# Altium project RK3568-SOM.PrjPcb (part 3 of 3)

## Sheet RK3568-SOM-EDGE_CONNECTOR.SchDoc
size A2; Organization: Altium Limited; Address1: L3, 12a Rodborough Rd; Address2: Frenchs Forest; Address3: NSW; Address4: Australia 2086
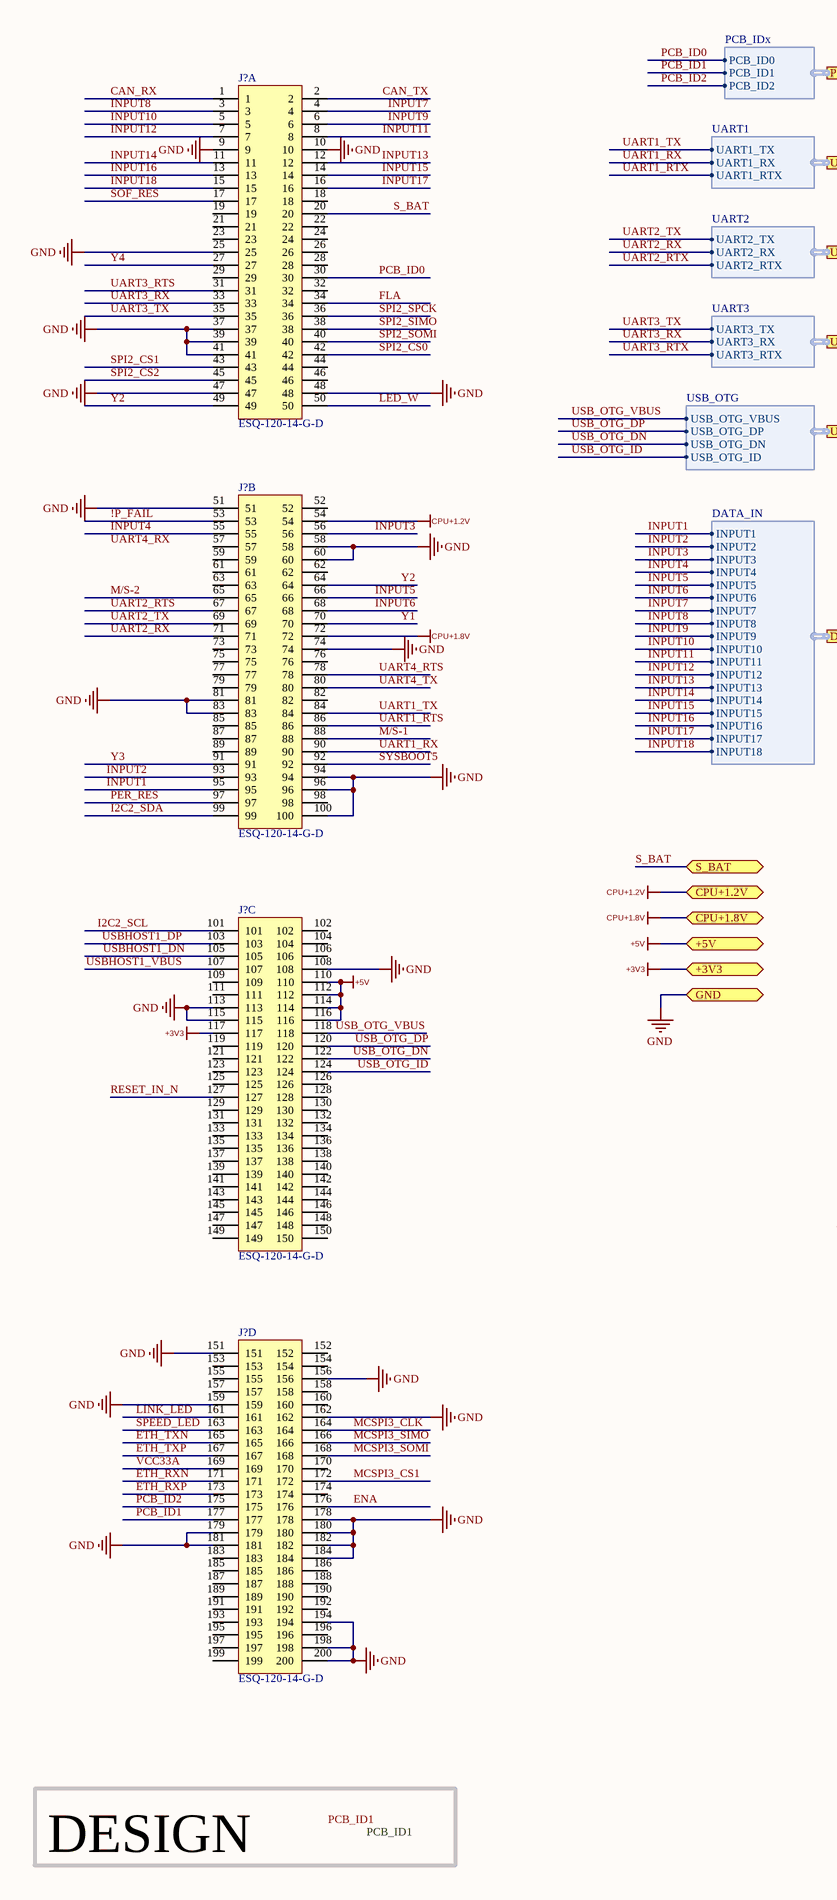
[diagram p8: RK3568-SOM-EDGE_CONNECTOR.SchDoc, left]
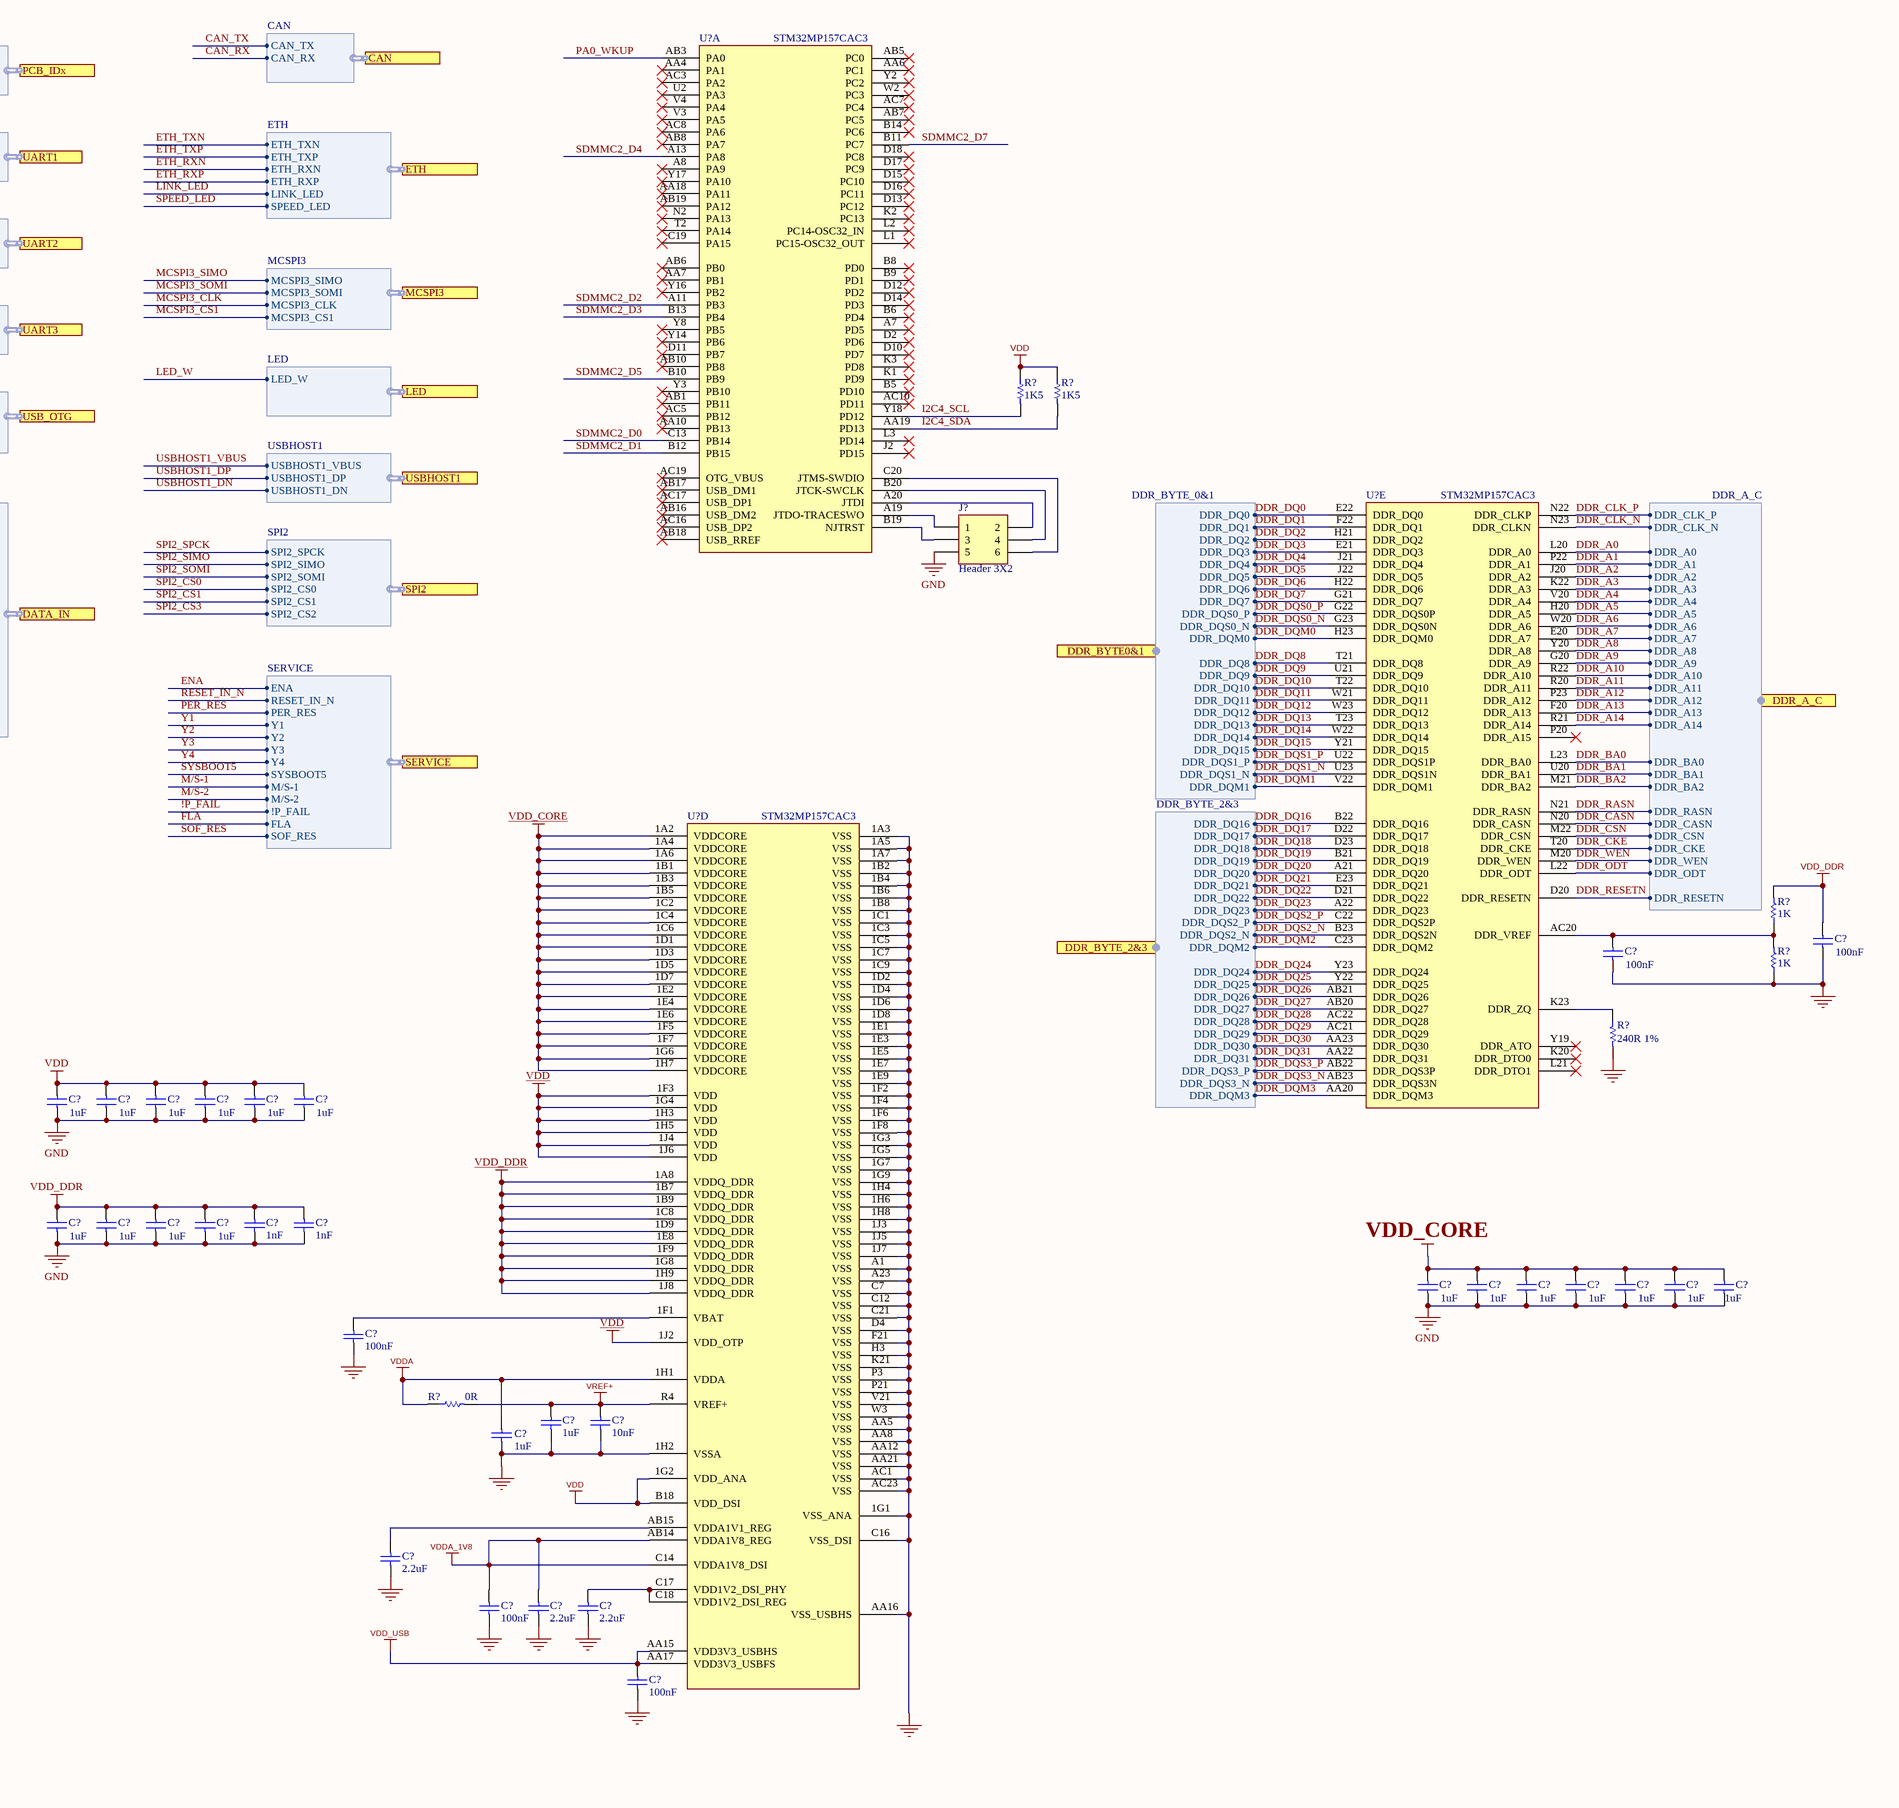
[diagram p9: RK3568-SOM-EDGE_CONNECTOR.SchDoc, right]

### Parts
(Parts that share a designator on the sheet are numbered #1, #2 ... from top to bottom, then left to right.)
C?#19  value 100nF  [C0402]  (hidden comment: Capacitor)
C?#20  value 100nF  [C0402]  (hidden comment: Capacitor)
C?#21  value 1uF  [C0402]  (hidden comment: Capacitor)
C?#22  value 1uF  [C0402]  (hidden comment: Capacitor)
C?#23  value 1uF  [C0402]  (hidden comment: Capacitor)
C?#24  value 1uF  [C0402]  (hidden comment: Capacitor)
C?#25  value 1uF  [C0402]  (hidden comment: Capacitor)
C?#26  value 1uF  [C0402]  (hidden comment: Capacitor)
C?#27  value 1uF  [C0402]  (hidden comment: Capacitor)
C?#28  value 1uF  [C0402]  (hidden comment: Capacitor)
C?#29  value 1uF  [C0402]  (hidden comment: Capacitor)
C?#30  value 1uF  [C0402]  (hidden comment: Capacitor)
C?#31  value 1nF  [C0402]  (hidden comment: Capacitor)
C?#32  value 1nF  [C0402]  (hidden comment: Capacitor)
C?#33  value 1uF  [C0402]  (hidden comment: Capacitor)
C?#34  value 1uF  [C0402]  (hidden comment: Capacitor)
C?#35  value 1uF  [C0402]  (hidden comment: Capacitor)
C?#36  value 1uF  [C0402]  (hidden comment: Capacitor)
C?#37  value 1uF  [C0402]  (hidden comment: Capacitor)
C?#38  value 1uF  [C0402]  (hidden comment: Capacitor)
C?#39  value 1uF  [C0402]  (hidden comment: Capacitor)
C?#40  value 100nF  [C0402]  (hidden comment: Capacitor)
C?#41  value 1uF  [C0402]  (hidden comment: Capacitor)
C?#42  value 10nF  [C0402]  (hidden comment: Capacitor)
C?#43  value 1uF  [C0402]  (hidden comment: Capacitor)
C?#44  value 2.2uF  [C0402]  (hidden comment: Capacitor)
C?#45  value 100nF  [C0402]  (hidden comment: Capacitor)
C?#46  value 2.2uF  [C0402]  (hidden comment: Capacitor)
C?#47  value 2.2uF  [C0402]  (hidden comment: Capacitor)
C?#48  value 100nF  [C0402]  (hidden comment: Capacitor)
J?#1  ESQ-120-14-G-D  [ESQ-120-14-G-D]  (part A of 4)
J?#2  Header 3X2  [Header3x2]
J?#3  ESQ-120-14-G-D  [ESQ-120-14-G-D]  (part B of 4)
J?#4  ESQ-120-14-G-D  [ESQ-120-14-G-D]  (part C of 4)
J?#5  ESQ-120-14-G-D  [ESQ-120-14-G-D]  (part D of 4)
R?#33  value 1K5  [R0402]  (hidden comment: Resistor)
R?#34  value 1K5  [R0402]  (hidden comment: Resistor)
R?#35  value 1K  [R0402]  (hidden comment: Resistor)
R?#36  value 1K  [R0402]  (hidden comment: Resistor)
R?#37  value 240R 1%  [R0402]  (hidden comment: Resistor)
R?#38  value 0R  [R0402]  (hidden comment: Resistor)
U?#5  STM32MP157CAC3  [ICC_TFBGA361_12X12_STM32MP157CAC3_P050-065]  (part A of 5)
U?#6  STM32MP157CAC3  [ICC_TFBGA361_12X12_STM32MP157CAC3_P050-065]  (part E of 5)
U?#7  STM32MP157CAC3  [ICC_TFBGA361_12X12_STM32MP157CAC3_P050-065]  (part D of 5)

### Ports
+3V3 (bidir), +5V (bidir), CAN (harness CAN), CPU+1.2V (bidir), CPU+1.8V (bidir), DATA_IN (harness DATA_IN), DDR_A_C (harness DDR_A_C), DDR_BYTE0&1 (harness DDR_BYTE_0&1), DDR_BYTE_2&3 (harness DDR_BYTE_2&3), ETH (harness ETH), GND (bidir), LED (harness LED), MCSPI3 (harness MCSPI3), PCB_IDx (harness PCB_IDx), S_BAT (bidir), SERVICE (harness SERVICE), SPI2 (harness SPI2), UART1 (harness UART1), UART2 (harness UART2), UART3 (harness UART3), USB_OTG (harness USB_OTG), USBHOST1 (harness USBHOST1)

### Harnesses
DDR_BYTE_0&1: DDR_DQ0, DDR_DQ1, DDR_DQ2, DDR_DQ3, DDR_DQ4, DDR_DQ5, DDR_DQ6, DDR_DQ7, DDR_DQS0_P, DDR_DQS0_N, DDR_DQM0, DDR_DQ8, DDR_DQ9, DDR_DQ10, DDR_DQ11, DDR_DQ12, DDR_DQ13, DDR_DQ14, DDR_DQ15, DDR_DQS1_P, DDR_DQS1_N, DDR_DQM1
DDR_A_C: DDR_CLK_P, DDR_CLK_N, DDR_A0, DDR_A1, DDR_A2, DDR_A3, DDR_A4, DDR_A5, DDR_A6, DDR_A7, DDR_A8, DDR_A9, DDR_A10, DDR_A11, DDR_A12, DDR_A13, DDR_A14, DDR_BA0, DDR_BA1, DDR_BA2, DDR_RASN, DDR_CASN, DDR_CSN, DDR_CKE, DDR_WEN, DDR_ODT, DDR_RESETN
DDR_BYTE_2&3: DDR_DQ16, DDR_DQ17, DDR_DQ18, DDR_DQ19, DDR_DQ20, DDR_DQ21, DDR_DQ22, DDR_DQ23, DDR_DQS2_P, DDR_DQS2_N, DDR_DQM2, DDR_DQ24, DDR_DQ25, DDR_DQ26, DDR_DQ27, DDR_DQ28, DDR_DQ29, DDR_DQ30, DDR_DQ31, DDR_DQS3_P, DDR_DQS3_N, DDR_DQM3
PCB_IDx: PCB_ID0, PCB_ID1, PCB_ID2
UART1: UART1_TX, UART1_RX, UART1_RTX
UART2: UART2_TX, UART2_RX, UART2_RTX
UART3: UART3_TX, UART3_RX, UART3_RTX
USB_OTG: USB_OTG_VBUS, USB_OTG_DP, USB_OTG_DN, USB_OTG_ID
DATA_IN: INPUT1, INPUT2, INPUT3, INPUT4, INPUT5, INPUT6, INPUT7, INPUT8, INPUT9, INPUT10, INPUT11, INPUT12, INPUT13, INPUT14, INPUT15, INPUT16, INPUT17, INPUT18
CAN: CAN_TX, CAN_RX
USBHOST1: USBHOST1_VBUS, USBHOST1_DP, USBHOST1_DN
SPI2: SPI2_SPCK, SPI2_CS0, SPI2_CS1, SPI2_CS2, SPI2_SIMO, SPI2_SOMI
LED: LED_W
SERVICE: ENA, Y4, SYSBOOT5, M/S-1, RESET_IN_N, Y3, PER_RES, Y1, Y2, M/S-2, !P_FAIL, FLA, SOF_RES
MCSPI3: MCSPI3_SIMO, MCSPI3_SOMI, MCSPI3_CLK, MCSPI3_CS1
ETH: ETH_TXN, ETH_TXP, ETH_RXN, ETH_RXP, LINK_LED, SPEED_LED

### Nets
+3V3: J?#4.117 ; port +3V3
+5V: J?#4.110 J?#4.112 J?#4.114 J?#4.116 ; port +5V
CPU+1.2V: J?#3.54 ; port CPU+1.2V
CPU+1.8V: J?#3.72 ; port CPU+1.8V
GND: C?#19.1 C?#20.1 C?#21.1 C?#22.1 C?#23.1 C?#24.1 C?#25.1 C?#26.1 C?#27.1 C?#28.1 C?#29.1 C?#30.1 C?#31.1 C?#32.1 C?#33.1 C?#34.1 C?#35.1 C?#36.1 C?#37.1 C?#38.1 C?#39.1 C?#40.1 C?#41.1 C?#42.1 C?#43.1 C?#44.1 C?#45.1 C?#46.1 C?#47.1 C?#48.1 J?#1.9 J?#1.10 J?#1.25 J?#1.37 J?#1.39 J?#1.41 J?#1.47 J?#1.48 J?#2.5 J?#3.51 J?#3.58 J?#3.60 J?#3.74 J?#3.81 J?#3.83 J?#3.94 J?#3.96 J?#3.100 J?#4.108 J?#4.113 J?#4.115 J?#5.151 J?#5.156 J?#5.159 J?#5.162 J?#5.178 J?#5.179 J?#5.180 J?#5.181 J?#5.182 J?#5.184 J?#5.194 J?#5.198 J?#5.200 R?#36.1 R?#37.2 U?#7.1A3(VSS) U?#7.1A5(VSS) U?#7.1A7(VSS) U?#7.1B2(VSS) U?#7.1B4(VSS) U?#7.1B6(VSS) U?#7.1B8(VSS) U?#7.1C1(VSS) U?#7.1C3(VSS) U?#7.1C5(VSS) U?#7.1C7(VSS) U?#7.1C9(VSS) U?#7.1D2(VSS) U?#7.1D4(VSS) U?#7.1D6(VSS) U?#7.1D8(VSS) U?#7.1E1(VSS) U?#7.1E3(VSS) U?#7.1E5(VSS) U?#7.1E7(VSS) U?#7.1E9(VSS) U?#7.1F2(VSS) U?#7.1F4(VSS) U?#7.1F6(VSS) U?#7.1F8(VSS) U?#7.1G1(VSS_ANA) U?#7.1G3(VSS) U?#7.1G5(VSS) U?#7.1G7(VSS) U?#7.1G9(VSS) U?#7.1H2(VSSA) U?#7.1H4(VSS) U?#7.1H6(VSS) U?#7.1H8(VSS) U?#7.1J3(VSS) U?#7.1J5(VSS) U?#7.1J7(VSS) U?#7.A1(VSS) U?#7.A23(VSS) U?#7.AA5(VSS) U?#7.AA8(VSS) U?#7.AA12(VSS) U?#7.AA16(VSS_USBHS) U?#7.AA21(VSS) U?#7.AC1(VSS) U?#7.AC23(VSS) U?#7.C7(VSS) U?#7.C12(VSS) U?#7.C16(VSS_DSI) U?#7.C21(VSS) U?#7.D4(VSS) U?#7.F21(VSS) U?#7.H3(VSS) U?#7.K21(VSS) U?#7.P3(VSS) U?#7.P21(VSS) U?#7.V21(VSS) U?#7.W3(VSS) ; port GND
VDD: C?#21.2 C?#22.2 C?#23.2 C?#24.2 C?#25.2 C?#26.2 R?#33.1 R?#34.1 U?#7.1F3(VDD) U?#7.1G2(VDD_ANA) U?#7.1G4(VDD) U?#7.1H3(VDD) U?#7.1H5(VDD) U?#7.1J2(VDD_OTP) U?#7.1J4(VDD) U?#7.1J6(VDD) U?#7.B18(VDD_DSI)
VDD_CORE: C?#33.2 C?#34.2 C?#35.2 C?#36.2 C?#37.2 C?#38.2 C?#39.2 U?#7.1A2(VDDCORE) U?#7.1A4(VDDCORE) U?#7.1A6(VDDCORE) U?#7.1B1(VDDCORE) U?#7.1B3(VDDCORE) U?#7.1B5(VDDCORE) U?#7.1C2(VDDCORE) U?#7.1C4(VDDCORE) U?#7.1C6(VDDCORE) U?#7.1D1(VDDCORE) U?#7.1D3(VDDCORE) U?#7.1D5(VDDCORE) U?#7.1D7(VDDCORE) U?#7.1E2(VDDCORE) U?#7.1E4(VDDCORE) U?#7.1E6(VDDCORE) U?#7.1F5(VDDCORE) U?#7.1F7(VDDCORE) U?#7.1G6(VDDCORE) U?#7.1H7(VDDCORE)
VDD_DDR: C?#19.2 C?#27.2 C?#28.2 C?#29.2 C?#30.2 C?#31.2 C?#32.2 R?#35.2 U?#7.1A8(VDDQ_DDR) U?#7.1B7(VDDQ_DDR) U?#7.1B9(VDDQ_DDR) U?#7.1C8(VDDQ_DDR) U?#7.1D9(VDDQ_DDR) U?#7.1E8(VDDQ_DDR) U?#7.1F9(VDDQ_DDR) U?#7.1G8(VDDQ_DDR) U?#7.1H9(VDDQ_DDR) U?#7.1J8(VDDQ_DDR)
VDD_USB: C?#48.2 U?#7.AA15(VDD3V3_USBHS) U?#7.AA17(VDD3V3_USBFS)
VDDA: C?#43.2 R?#38.1 U?#7.1H1(VDDA)
VDDA_1V8: C?#45.2 C?#46.2 U?#7.AB14(VDDA1V8_REG) U?#7.C14(VDDA1V8_DSI)
VREF+: C?#41.2 C?#42.2 R?#38.2 U?#7.R4(VREF+)
!P_FAIL: J?#3.53 ; port SERVICE.!P_FAIL
CAN_RX: J?#1.1 ; port CAN.CAN_RX
CAN_TX: J?#1.2 ; port CAN.CAN_TX
DDR_A0: U?#6.L20(DDR_A0) ; port DDR_A_C.DDR_A0
DDR_A1: U?#6.P22(DDR_A1) ; port DDR_A_C.DDR_A1
DDR_A2: U?#6.J20(DDR_A2) ; port DDR_A_C.DDR_A2
DDR_A3: U?#6.K22(DDR_A3) ; port DDR_A_C.DDR_A3
DDR_A4: U?#6.V20(DDR_A4) ; port DDR_A_C.DDR_A4
DDR_A5: U?#6.H20(DDR_A5) ; port DDR_A_C.DDR_A5
DDR_A6: U?#6.W20(DDR_A6) ; port DDR_A_C.DDR_A6
DDR_A7: U?#6.E20(DDR_A7) ; port DDR_A_C.DDR_A7
DDR_A8: U?#6.Y20(DDR_A8) ; port DDR_A_C.DDR_A8
DDR_A9: U?#6.G20(DDR_A9) ; port DDR_A_C.DDR_A9
DDR_A10: U?#6.R22(DDR_A10) ; port DDR_A_C.DDR_A10
DDR_A11: U?#6.R20(DDR_A11) ; port DDR_A_C.DDR_A11
DDR_A12: U?#6.P23(DDR_A12) ; port DDR_A_C.DDR_A12
DDR_A13: U?#6.F20(DDR_A13) ; port DDR_A_C.DDR_A13
DDR_A14: U?#6.R21(DDR_A14) ; port DDR_A_C.DDR_A14
DDR_BA0: U?#6.L23(DDR_BA0) ; port DDR_A_C.DDR_BA0
DDR_BA1: U?#6.U20(DDR_BA1) ; port DDR_A_C.DDR_BA1
DDR_BA2: U?#6.M21(DDR_BA2) ; port DDR_A_C.DDR_BA2
DDR_CASN: U?#6.N20(DDR_CASN) ; port DDR_A_C.DDR_CASN
DDR_CKE: U?#6.T20(DDR_CKE) ; port DDR_A_C.DDR_CKE
DDR_CLK_N: U?#6.N23(DDR_CLKN) ; port DDR_A_C.DDR_CLK_N
DDR_CLK_P: U?#6.N22(DDR_CLKP) ; port DDR_A_C.DDR_CLK_P
DDR_CSN: U?#6.M22(DDR_CSN) ; port DDR_A_C.DDR_CSN
DDR_DQ0: U?#6.E22(DDR_DQ0) ; port DDR_BYTE0&1.DDR_DQ0
DDR_DQ1: U?#6.F22(DDR_DQ1) ; port DDR_BYTE0&1.DDR_DQ1
DDR_DQ2: U?#6.H21(DDR_DQ2) ; port DDR_BYTE0&1.DDR_DQ2
DDR_DQ3: U?#6.E21(DDR_DQ3) ; port DDR_BYTE0&1.DDR_DQ3
DDR_DQ4: U?#6.J21(DDR_DQ4) ; port DDR_BYTE0&1.DDR_DQ4
DDR_DQ5: U?#6.J22(DDR_DQ5) ; port DDR_BYTE0&1.DDR_DQ5
DDR_DQ6: U?#6.H22(DDR_DQ6) ; port DDR_BYTE0&1.DDR_DQ6
DDR_DQ7: U?#6.G21(DDR_DQ7) ; port DDR_BYTE0&1.DDR_DQ7
DDR_DQ8: U?#6.T21(DDR_DQ8) ; port DDR_BYTE0&1.DDR_DQ8
DDR_DQ9: U?#6.U21(DDR_DQ9) ; port DDR_BYTE0&1.DDR_DQ9
DDR_DQ10: U?#6.T22(DDR_DQ10) ; port DDR_BYTE0&1.DDR_DQ10
DDR_DQ11: U?#6.W21(DDR_DQ11) ; port DDR_BYTE0&1.DDR_DQ11
DDR_DQ12: U?#6.W23(DDR_DQ12) ; port DDR_BYTE0&1.DDR_DQ12
DDR_DQ13: U?#6.T23(DDR_DQ13) ; port DDR_BYTE0&1.DDR_DQ13
DDR_DQ14: U?#6.W22(DDR_DQ14) ; port DDR_BYTE0&1.DDR_DQ14
DDR_DQ15: U?#6.Y21(DDR_DQ15) ; port DDR_BYTE0&1.DDR_DQ15
DDR_DQ16: U?#6.B22(DDR_DQ16) ; port DDR_BYTE_2&3.DDR_DQ16
DDR_DQ17: U?#6.D22(DDR_DQ17) ; port DDR_BYTE_2&3.DDR_DQ17
DDR_DQ18: U?#6.D23(DDR_DQ18) ; port DDR_BYTE_2&3.DDR_DQ18
DDR_DQ19: U?#6.B21(DDR_DQ19) ; port DDR_BYTE_2&3.DDR_DQ19
DDR_DQ20: U?#6.A21(DDR_DQ20) ; port DDR_BYTE_2&3.DDR_DQ20
DDR_DQ21: U?#6.E23(DDR_DQ21) ; port DDR_BYTE_2&3.DDR_DQ21
DDR_DQ22: U?#6.D21(DDR_DQ22) ; port DDR_BYTE_2&3.DDR_DQ22
DDR_DQ23: U?#6.A22(DDR_DQ23) ; port DDR_BYTE_2&3.DDR_DQ23
DDR_DQ24: U?#6.Y23(DDR_DQ24) ; port DDR_BYTE_2&3.DDR_DQ24
DDR_DQ25: U?#6.Y22(DDR_DQ25) ; port DDR_BYTE_2&3.DDR_DQ25
DDR_DQ26: U?#6.AB21(DDR_DQ26) ; port DDR_BYTE_2&3.DDR_DQ26
DDR_DQ27: U?#6.AB20(DDR_DQ27) ; port DDR_BYTE_2&3.DDR_DQ27
DDR_DQ28: U?#6.AC22(DDR_DQ28) ; port DDR_BYTE_2&3.DDR_DQ28
DDR_DQ29: U?#6.AC21(DDR_DQ29) ; port DDR_BYTE_2&3.DDR_DQ29
DDR_DQ30: U?#6.AA23(DDR_DQ30) ; port DDR_BYTE_2&3.DDR_DQ30
DDR_DQ31: U?#6.AA22(DDR_DQ31) ; port DDR_BYTE_2&3.DDR_DQ31
DDR_DQM0: U?#6.H23(DDR_DQM0) ; port DDR_BYTE0&1.DDR_DQM0
DDR_DQM1: U?#6.V22(DDR_DQM1) ; port DDR_BYTE0&1.DDR_DQM1
DDR_DQM2: U?#6.C23(DDR_DQM2) ; port DDR_BYTE_2&3.DDR_DQM2
DDR_DQM3: U?#6.AA20(DDR_DQM3) ; port DDR_BYTE_2&3.DDR_DQM3
DDR_DQS0_N: U?#6.G23(DDR_DQS0N) ; port DDR_BYTE0&1.DDR_DQS0_N
DDR_DQS0_P: U?#6.G22(DDR_DQS0P) ; port DDR_BYTE0&1.DDR_DQS0_P
DDR_DQS1_N: U?#6.U23(DDR_DQS1N) ; port DDR_BYTE0&1.DDR_DQS1_N
DDR_DQS1_P: U?#6.U22(DDR_DQS1P) ; port DDR_BYTE0&1.DDR_DQS1_P
DDR_DQS2_N: U?#6.B23(DDR_DQS2N) ; port DDR_BYTE_2&3.DDR_DQS2_N
DDR_DQS2_P: U?#6.C22(DDR_DQS2P) ; port DDR_BYTE_2&3.DDR_DQS2_P
DDR_DQS3_N: U?#6.AB23(DDR_DQS3N) ; port DDR_BYTE_2&3.DDR_DQS3_N
DDR_DQS3_P: U?#6.AB22(DDR_DQS3P) ; port DDR_BYTE_2&3.DDR_DQS3_P
DDR_ODT: U?#6.L22(DDR_ODT) ; port DDR_A_C.DDR_ODT
DDR_RASN: U?#6.N21(DDR_RASN) ; port DDR_A_C.DDR_RASN
DDR_RESETN: U?#6.D20(DDR_RESETN) ; port DDR_A_C.DDR_RESETN
DDR_WEN: U?#6.M20(DDR_WEN) ; port DDR_A_C.DDR_WEN
ENA: J?#5.176 ; port SERVICE.ENA
ETH_RXN: J?#5.171 ; port ETH.ETH_RXN
ETH_RXP: J?#5.173 ; port ETH.ETH_RXP
ETH_TXN: J?#5.165 ; port ETH.ETH_TXN
ETH_TXP: J?#5.167 ; port ETH.ETH_TXP
FLA: J?#1.34 ; port SERVICE.FLA
I2C2_SCL: J?#4.101
I2C2_SDA: J?#3.99
I2C4_SCL: R?#33.2 U?#5.Y18(PD12)
I2C4_SDA: R?#34.2 U?#5.AA19(PD13)
INPUT1: J?#3.95 ; port DATA_IN.INPUT1
INPUT2: J?#3.93 ; port DATA_IN.INPUT2
INPUT3: J?#3.56 ; port DATA_IN.INPUT3
INPUT4: J?#3.55 ; port DATA_IN.INPUT4
INPUT5: J?#3.66 ; port DATA_IN.INPUT5
INPUT6: J?#3.68 ; port DATA_IN.INPUT6
INPUT7: J?#1.4 ; port DATA_IN.INPUT7
INPUT8: J?#1.3 ; port DATA_IN.INPUT8
INPUT9: J?#1.6 ; port DATA_IN.INPUT9
INPUT10: J?#1.5 ; port DATA_IN.INPUT10
INPUT11: J?#1.8 ; port DATA_IN.INPUT11
INPUT12: J?#1.7 ; port DATA_IN.INPUT12
INPUT13: J?#1.12 ; port DATA_IN.INPUT13
INPUT14: J?#1.11 ; port DATA_IN.INPUT14
INPUT15: J?#1.14 ; port DATA_IN.INPUT15
INPUT16: J?#1.13 ; port DATA_IN.INPUT16
INPUT17: J?#1.16 ; port DATA_IN.INPUT17
INPUT18: J?#1.15 ; port DATA_IN.INPUT18
LED_W: J?#1.50 ; port LED.LED_W
LINK_LED: J?#5.161 ; port ETH.LINK_LED
M/S-1: J?#3.88 ; port SERVICE.M/S-1
M/S-2: J?#3.65 ; port SERVICE.M/S-2
MCSPI3_CLK: J?#5.164 ; port MCSPI3.MCSPI3_CLK
MCSPI3_CS1: J?#5.172 ; port MCSPI3.MCSPI3_CS1
MCSPI3_SIMO: J?#5.166 ; port MCSPI3.MCSPI3_SIMO
MCSPI3_SOMI: J?#5.168 ; port MCSPI3.MCSPI3_SOMI
PA0_WKUP: U?#5.AB3(PA0)
PCB_ID0: J?#1.30 ; port PCB_IDx.PCB_ID0
PCB_ID1: J?#5.177 ; port PCB_IDx.PCB_ID1
PCB_ID2: J?#5.175 ; port PCB_IDx.PCB_ID2
PER_RES: J?#3.97 ; port SERVICE.PER_RES
RESET_IN_N: J?#4.127 ; port SERVICE.RESET_IN_N
S_BAT: J?#1.20 ; port S_BAT
SDMMC2_D0: U?#5.C13(PB14)
SDMMC2_D1: U?#5.B12(PB15)
SDMMC2_D2: U?#5.A11(PB3)
SDMMC2_D3: U?#5.B13(PB4)
SDMMC2_D4: U?#5.A13(PA8)
SDMMC2_D5: U?#5.B10(PB9)
SDMMC2_D7: U?#5.B11(PC7)
SOF_RES: J?#1.17 ; port SERVICE.SOF_RES
SPEED_LED: J?#5.163 ; port ETH.SPEED_LED
SPI2_CS0: J?#1.42 ; port SPI2.SPI2_CS0
SPI2_CS1: J?#1.43 ; port SPI2.SPI2_CS1
SPI2_CS2: J?#1.45
SPI2_CS3: port SPI2.SPI2_CS2
SPI2_SIMO: J?#1.38 ; port SPI2.SPI2_SIMO
SPI2_SOMI: J?#1.40 ; port SPI2.SPI2_SOMI
SPI2_SPCK: J?#1.36 ; port SPI2.SPI2_SPCK
SYSBOOT5: J?#3.92 ; port SERVICE.SYSBOOT5
UART1_RTS: J?#3.86
UART1_RTX: port UART1.UART1_RTX
UART1_RX: J?#3.90 ; port UART1.UART1_RX
UART1_TX: J?#3.84 ; port UART1.UART1_TX
UART2_RTS: J?#3.67
UART2_RTX: port UART2.UART2_RTX
UART2_RX: J?#3.71 ; port UART2.UART2_RX
UART2_TX: J?#3.69 ; port UART2.UART2_TX
UART3_RTS: J?#1.31
UART3_RTX: port UART3.UART3_RTX
UART3_RX: J?#1.33 ; port UART3.UART3_RX
UART3_TX: J?#1.35 ; port UART3.UART3_TX
UART4_RTS: J?#3.78
UART4_TX: J?#3.80
USB_OTG_DN: J?#4.122 ; port USB_OTG.USB_OTG_DN
USB_OTG_DP: J?#4.120 ; port USB_OTG.USB_OTG_DP
USB_OTG_ID: J?#4.124 ; port USB_OTG.USB_OTG_ID
USB_OTG_VBUS: J?#4.118 ; port USB_OTG.USB_OTG_VBUS
USBHOST1_DN: J?#4.105 ; port USBHOST1.USBHOST1_DN
USBHOST1_DP: J?#4.103 ; port USBHOST1.USBHOST1_DP
USBHOST1_VBUS: J?#4.107 ; port USBHOST1.USBHOST1_VBUS
VCC33A: J?#5.169
Y1: J?#3.70 ; port SERVICE.Y1
Y2: J?#1.49 J?#3.64 ; port SERVICE.Y2
Y3: J?#3.91 ; port SERVICE.Y3
Y4: J?#1.27 ; port SERVICE.Y4
NetC?#20_2: C?#20.2 R?#35.1 R?#36.2 U?#6.AC20(DDR_VREF)
NetC?#40_2: C?#40.2 U?#7.1F1(VBAT)
NetC?#44_2: C?#44.2 U?#7.AB15(VDDA1V1_REG)
NetC?#47_2: C?#47.2 U?#7.C17(VDD1V2_DSI_PHY) U?#7.C18(VDD1V2_DSI_REG)
NetJ?#2_1: J?#2.1 U?#5.A19(JTDO-TRACESWO)
NetJ?#2_2: J?#2.2 U?#5.A20(JTDI)
NetJ?#2_3: J?#2.3 U?#5.B19(NJTRST)
NetJ?#2_4: J?#2.4 U?#5.B20(JTCK-SWCLK)
NetJ?#2_6: J?#2.6 U?#5.C20(JTMS-SWDIO)
NetR?#37_1: R?#37.1 U?#6.K23(DDR_ZQ)

Not connected (* = marked no-connect by the designer): J?#1 18 19 21 22 23 24 26 28 29 32 44 46; J?#3 52 57 59 61 62 63 73 75 76 77 79 82 85 87 89 98; J?#4 102 104 106 109 111 119 121 123 125 126 128 129 130 131 132 133 134 135 136 137 138 139 140 141 142 143 144 145 146 147 148 149 150; J?#5 152 153 154 155 157 158 160 170 174 183 185 186 187 188 189 190 191 192 193 195 196 197 199; U?#5 A7(PD5)* A8(PA9)* AA4(PA1)* AA6(PC1)* AA7(PB1)* AA10(PB13)* AA18(PA11)* AB1(PB11)* AB5(PC0)* AB6(PB0)* AB7(PC5)* AB8(PA7)* AB10(PB8)* AB16(USB_DM2)* AB17(USB_DM1)* AB18(USB_RREF)* AB19(PA12)* AC3(PA2)* AC5(PB12)* AC7(PC4)* AC8(PA6)* AC10(PD11)* AC16(USB_DP2)* AC17(USB_DP1)* AC19(OTG_VBUS)* B5(PD10)* B6(PD4)* B8(PD0)* B9(PD1)* B14(PC6)* C19(PA15)* D2(PD6)* D10(PD7)* D11(PB7)* D12(PD2)* D13(PC12)* D14(PD3)* D15(PC10)* D16(PC11)* D17(PC9)* D18(PC8)* J2(PD15)* K1(PD9)* K2(PC13)* K3(PD8)* L1(PC15-OSC32_OUT)* L2(PC14-OSC32_IN)* L3(PD14)* N2(PA13)* T2(PA14)* U2(PA3)* V3(PA5)* V4(PA4)* W2(PC3)* Y2(PC2)* Y3(PB10)* Y8(PB5)* Y14(PB6)* Y16(PB2)* Y17(PA10)*; U?#6 K20(DDR_DTO0)* L21(DDR_DTO1)* P20(DDR_A15)* Y19(DDR_ATO)*

### Notes on the sheet
- DESIGN NOTE:
  Net labels with red color are for compatible with old boards:
  Net labels with green color may located on any edge connector pin:
- PCB_ID1
- Labels drawn without touching a wire or pin: UART4_RX
- Title
- Size:
- Date:
- File:
- A2
- Number:
- Time:
- Revision:
- Sheet
- of

### Library data of the parts
C?#19 C?#20 C?#40 C?#48 = MCD-00006: Capacitor, MLCC, 100nF, 16V, X7R, +/-10%, 0402, T=0.5mm; Manufacturer_Part_Number: CC0402KRX7R7BB104; Manufacturer: YAGEO; Alternate_Manufacturer: MURATA; Alternate_Manufacturer_Part_Number: GCM155R71C104KA55D; ECCN_US: EAR99; ECCN_EU: NEC; Provided_By: SUBCO; Order_Code_RS: 616-9701; Internal_Part_Number: MCD-00006; ComponentLink1Description: Datasheet; Status: Released; Part_Type: Capacitor; Package: C0402; ComponentLink1URL: http://tunmcdsvn.tun.st.com/Component_Datasheet_Library/Trunk/Capacitors/Yageo_Multilayer_Capacitor_X7R_series_100pF_to_22uF; Order_Code_Digikey: 311-1338-1-ND; Order_Code_Farnell: 9402047
C?#21-C?#30 C?#33-C?#39 C?#41 C?#43 = MCD-00095: Capacitor, MLCC, 1uF, 25V, X5R, +/-10%, 0402, T=0,5mm; Manufacturer_Part_Number: GRM155R61E105KA12; Manufacturer: MURATA; Alternate_Manufacturer_Part_Number: GRM155R60J105KE19; ECCN_US: EAR99; ECCN_EU: NEC; Provided_By: SUBCO; Order_Code_RS: 846-7287; Internal_Part_Number: MCD-00095; Status: Released; Package: C0402; ComponentLink1Description: Datasheet; Part_Type: Capacitor; Alternate_Manufacturer: MURATA; ComponentLink1URL: http://tunmcdsvn.tun.st.com/Component_Datasheet_Library/Trunk/Capacitors/Murata_Capacitor_GR_series; Order_Code_Digikey: 490-10017-1-ND; Order_Code_Farnell: 2218855
C?#31 C?#32 = MCD-00198: Capacitor, MLCC, 1nF, 16V, X7R, +/-10%, 0402, T=0.5mm; Manufacturer_Part_Number: CC0402KRX7R7BB102; Manufacturer: YAGEO; Provided_By: SUBCO; ECCN_EU: NEC; ECCN_US: EAR99; Internal_Part_Number: MCD-00198; Status: Released; Part_Type: Capacitor; Package: C0402; ComponentLink1Description: Datasheet; ComponentLink1URL: http://tunmcdsvn.tun.st.com/Component_Datasheet_Library/Trunk/Capacitors/Yageo_Multilayer_Capacitor_X7R_series_100pF_to_22uF; Order_Code_Digikey: 311-1352-1-ND; Order_Code_Farnell: 2370642; Order_Code_RS: N/A
C?#42 = MCD-00011: Capacitor, MLCC, 10nF, 16V, X7R, +/-10%, 0402, T=0.5mm; Manufacturer_Part_Number: CC0402KRX7R7BB103; Manufacturer: YAGEO; ECCN_US: EAR99; ECCN_EU: NEC; Provided_By: SUBCO; Order_Code_RS: 669-8688; Internal_Part_Number: MCD-00011; Status: Released; Part_Type: Capacitor; Package: C0402; ComponentLink1Description: Datasheet; ComponentLink1URL: http://tunmcdsvn.tun.st.com/Component_Datasheet_Library/Trunk/Capacitors/Yageo_Multilayer_Capacitor_X7R_series_100pF_to_22uF; Order_Code_Digikey: 311-1042-1-ND; Order_Code_Farnell: 3019275
C?#44 C?#46 C?#47 = MCD-01823: Capacitor,MLCC, 2.2uF, 6V3, X5R,+/-10%, 0402, T=0.5mm; Manufacturer_Part_Number: GRM155R60J225KE95D; Manufacturer: MURATA; ECCN_US: EAR99; ECCN_EU: NEC; Provided_By: SUBCO; Order_Code_RS: 172-6478; Internal_Part_Number: MCD-01823; Status: Released; Part_Type: Capacitor; Package: C0402; ComponentLink1Description: Datasheet; ComponentLink1URL: http://tunmcdsvn.tun.st.com/Component_Datasheet_Library/Trunk/Capacitors/Murata_Capacitor_GR_series; Order_Code_Digikey: 490-12532-1-ND; Order_Code_Farnell: 2695865
C?#45 = MCD-00006: Capacitor, MLCC, 100nF, 16V, X7R, +/-10%, 0402, T=0.5mm; Manufacturer_Part_Number: CC0402KRX7R7BB104; Manufacturer: YAGEO; Alternate_Manufacturer_Part_Number: GCM155R71C104KA55D; Alternate_Manufacturer: MURATA; ECCN_US: EAR99; ECCN_EU: NEC; Provided_By: SUBCO; Order_Code_RS: 616-9701; Internal_Part_Number: MCD-00006; Status: Released; Part_Type: Capacitor; Package: C0402; ComponentLink1Description: Datasheet; ComponentLink1URL: http://tunmcdsvn.tun.st.com/Component_Datasheet_Library/Trunk/Capacitors/Yageo_Multilayer_Capacitor_X7R_series_100pF_to_22uF; Order_Code_Digikey: 311-1338-1-ND; Order_Code_Farnell: 9402047
J?#1 J?#3-J?#5 = SODIMM-SOCKET: CONN RCPT 40POS .100" DUAL GOLD; Manufacturer: TE Connectivity; Manufacturer Part Number: 1717254-4; Connector Type: Receptacle; Number of Positions: 200; Number of Positions Loaded: All; Pitch: 0.100" (2.54mm); .Creator: MM; Supplier 1: Digi-Key; RoHS: RoHS Compliant; Category: Connectors, Interconnects; Stock 1: 51; Pricing 1: 1=7.42, 10=6.864, 50=6.1586, 100=5.7505, 250=5.00852, 500=4.823, 1000=4.6375, 2500=4.452 (USD); Packaging: Tape & Reel; Contact Type: Female Socket; Number of Rows: 2; Row Spacing: 0.100" (2.54mm); Mounting Type: Through Hole; Termination: Solder; Fastening Type: -; Features: -; Contact Finish: Gold; Contact Finish Thickness: 20µin (0.51µm); Color: Black; ComponentLink1URL: https://www.te.com/usa-en/product-1717254-4.html; ComponentLink1Description: DataSheet; Supplier Part Number 1: SAM8767-ND; .Checked PCB: MM; .Checked SCH: MM
J?#2 = Header 3X2: Header, 2-Pin, Dual row; Manufacturer: Harwin; Manufacturer Part Number 1: M20-9980346; Part Description: Connector Header Through Hole 6 position 0.100" (2.54mm); Contact Resistance: 25mR; Max Current Rating: 3A; Number of Positions: 6; Gender: Male; Connector Type: Male Pin; Insulation Resistance: 10GR; Pitch: 2.54mm; Row Spacing: 0.1inch; Supplier 1: Digi-Key; Supplier Part Number 1: 952-2121-ND; RoHS: Yes; Stock 1: 46604; Pricing 1: 1 = 0,24000, 10 = 0,22900, 100 = 0,15860, 500 = 0,13420, 1000 = 0,10980, 5000 = 0,09760, 10000 = 0,08845 (USD); Mount: Through Hole; Color: Black; Contact Material: Brass,Bronze; Housing Color: Black; Housing Material: Nylon; Contact Plating: Tin; Min Operating Temperature: -40°C; Max Operating Temperature: 105°C; Package Quantity: 1000; Packaging: Bag; Termination: Solder; Number of Rows: 2; Number of Contacts: 6; Orientation: Straight; Current Rating: 3A; Length: 7.62mm; Depth: 5.08mm; Contact Mating Length: 0.24inch; Radiation Hardening: No; REACH SVHC: No SVHC; ComponentLink1URL: http://uk.rs-online.com/webdocs/1406/0900766b81406898.pdf; ComponentLink1Description: http://uk.rs-online.com/webdocs/1406/0900766b81406898.pdf; ComponentLink2URL: https://www.verical.com/server-webapp/html/getDatasheet?partID=483857; ComponentLink2Description: https://www.verical.com/server-webapp/html/getDatasheet?partID=483857; ComponentLink3URL: http://www.farnell.com/cad/112195.pdf; ComponentLink3Description: http://www.farnell.com/cad/112195.pdf
R?#33 R?#34 = MCD-00068: Resistor,1K5,0402,1%,1/16W; Manufacturer_Part_Number: RC0402FR-071K5L; Manufacturer: YAGEO; ECCN_US: EAR99; ECCN_EU: NEC; Provided_By: SUBCO; Internal_Part_Number: MCD-00068; ComponentLink1Description: Datasheet; Status: Released; Part_Type: Resistor; ComponentLink1URL: http://tunmcdsvn.tun.st.com/Component_Datasheet_Library/Trunk/Resistors/Yageo_Resistor_RC0402-series; Package: R0402; Order_Code_Digikey: 311-1.50KLRCT-ND; Order_Code_Farnell: 9239251; Order_Code_RS: N/A
R?#35 R?#36 = MCD-00061: Resistor,1K,0402,1%,1/16W; Manufacturer_Part_Number: RC0402FR-071KL; Manufacturer: YAGEO; Provided_By: SUBCO; ECCN_EU: NEC; ECCN_US: EAR99; Internal_Part_Number: MCD-00061; Status: Released; Part_Type: Resistor; Package: R0402; ComponentLink1Description: Datasheet; ComponentLink1URL: http://tunmcdsvn.tun.st.com/Component_Datasheet_Library/Trunk/Resistors/Yageo_Resistor_RC0402-series; Order_Code_Digikey: 311-1.00KLRCT-ND; Order_Code_Farnell: 9239235; Order_Code_RS: N/A
R?#37 = MCD-00120: Resistor,240R,0402,1%,1/16W; Manufacturer_Part_Number: RC0402FR-07240RL; Manufacturer: YAGEO; ECCN_US: EAR99; ECCN_EU: NEC; Provided_By: SUBCO; Internal_Part_Number: MCD-00120; ComponentLink1Description: Datasheet; Status: Released; Part_Type: Resistor; ComponentLink1URL: http://tunmcdsvn.tun.st.com/Component_Datasheet_Library/Trunk/Resistors/Yageo_Resistor_RC0402-series; Package: R0402; Order_Code_Digikey: 311-240LRCT-ND; Order_Code_Farnell: 1458766; Order_Code_RS: N/A
R?#38 = MCD-00052: Resistor,0R,0402,5%,1/16W; Manufacturer_Part_Number: RC0402JR-070RL; Manufacturer: YAGEO; ECCN_US: EAR99; ECCN_EU: NEC; Provided_By: SUBCO; Order_Code_RS: 618-5804; Internal_Part_Number: MCD-00052; Status: Released; Part_Type: Resistor; ComponentLink1Description: Datasheet; ComponentLink1URL: http://tunmcdsvn.tun.st.com/Component_Datasheet_Library/Trunk/Resistors/Yageo_Resistor_RC0402-series; Package: R0402; Order_Code_Digikey: 311-0.0JRCT-ND; Order_Code_Farnell: 9232516RL
U?#5-U?#7 = MCD-00677: MPU TFBGA12x12 secure boot+crypto; Part_Type: IC; Manufacturer: STMICROELECTRONICS; BMS_Part_Number: 9175503; ECCN_US: 5A002A4; ECCN_EU: NEC; Provided_By: SUBCO with ST control; Company_Nationality: Netherlands; Internal_Part_Number: MCD-00677; Value: STM32MP157CAC3; Status: Footprint available; Manufacturer_Part_Number: STM32MP157CAC3; ComponentLink1Description: Datasheet; ComponentLink1URL: http://tunmcdsvn.tun.st.com/Component_Datasheet_Library/Trunk/IC/STM_MPU_12x12_POA_DM00342580_POA12x12; Export_Juridiction: EU; California_Proposition_65: N/A

## Sheet RK3568-SOM-MCU.SchDoc
size A2; Organization: Altium Limited; Address1: L3, 12a Rodborough Rd; Address2: Frenchs Forest; Address3: NSW; Address4: Australia 2086
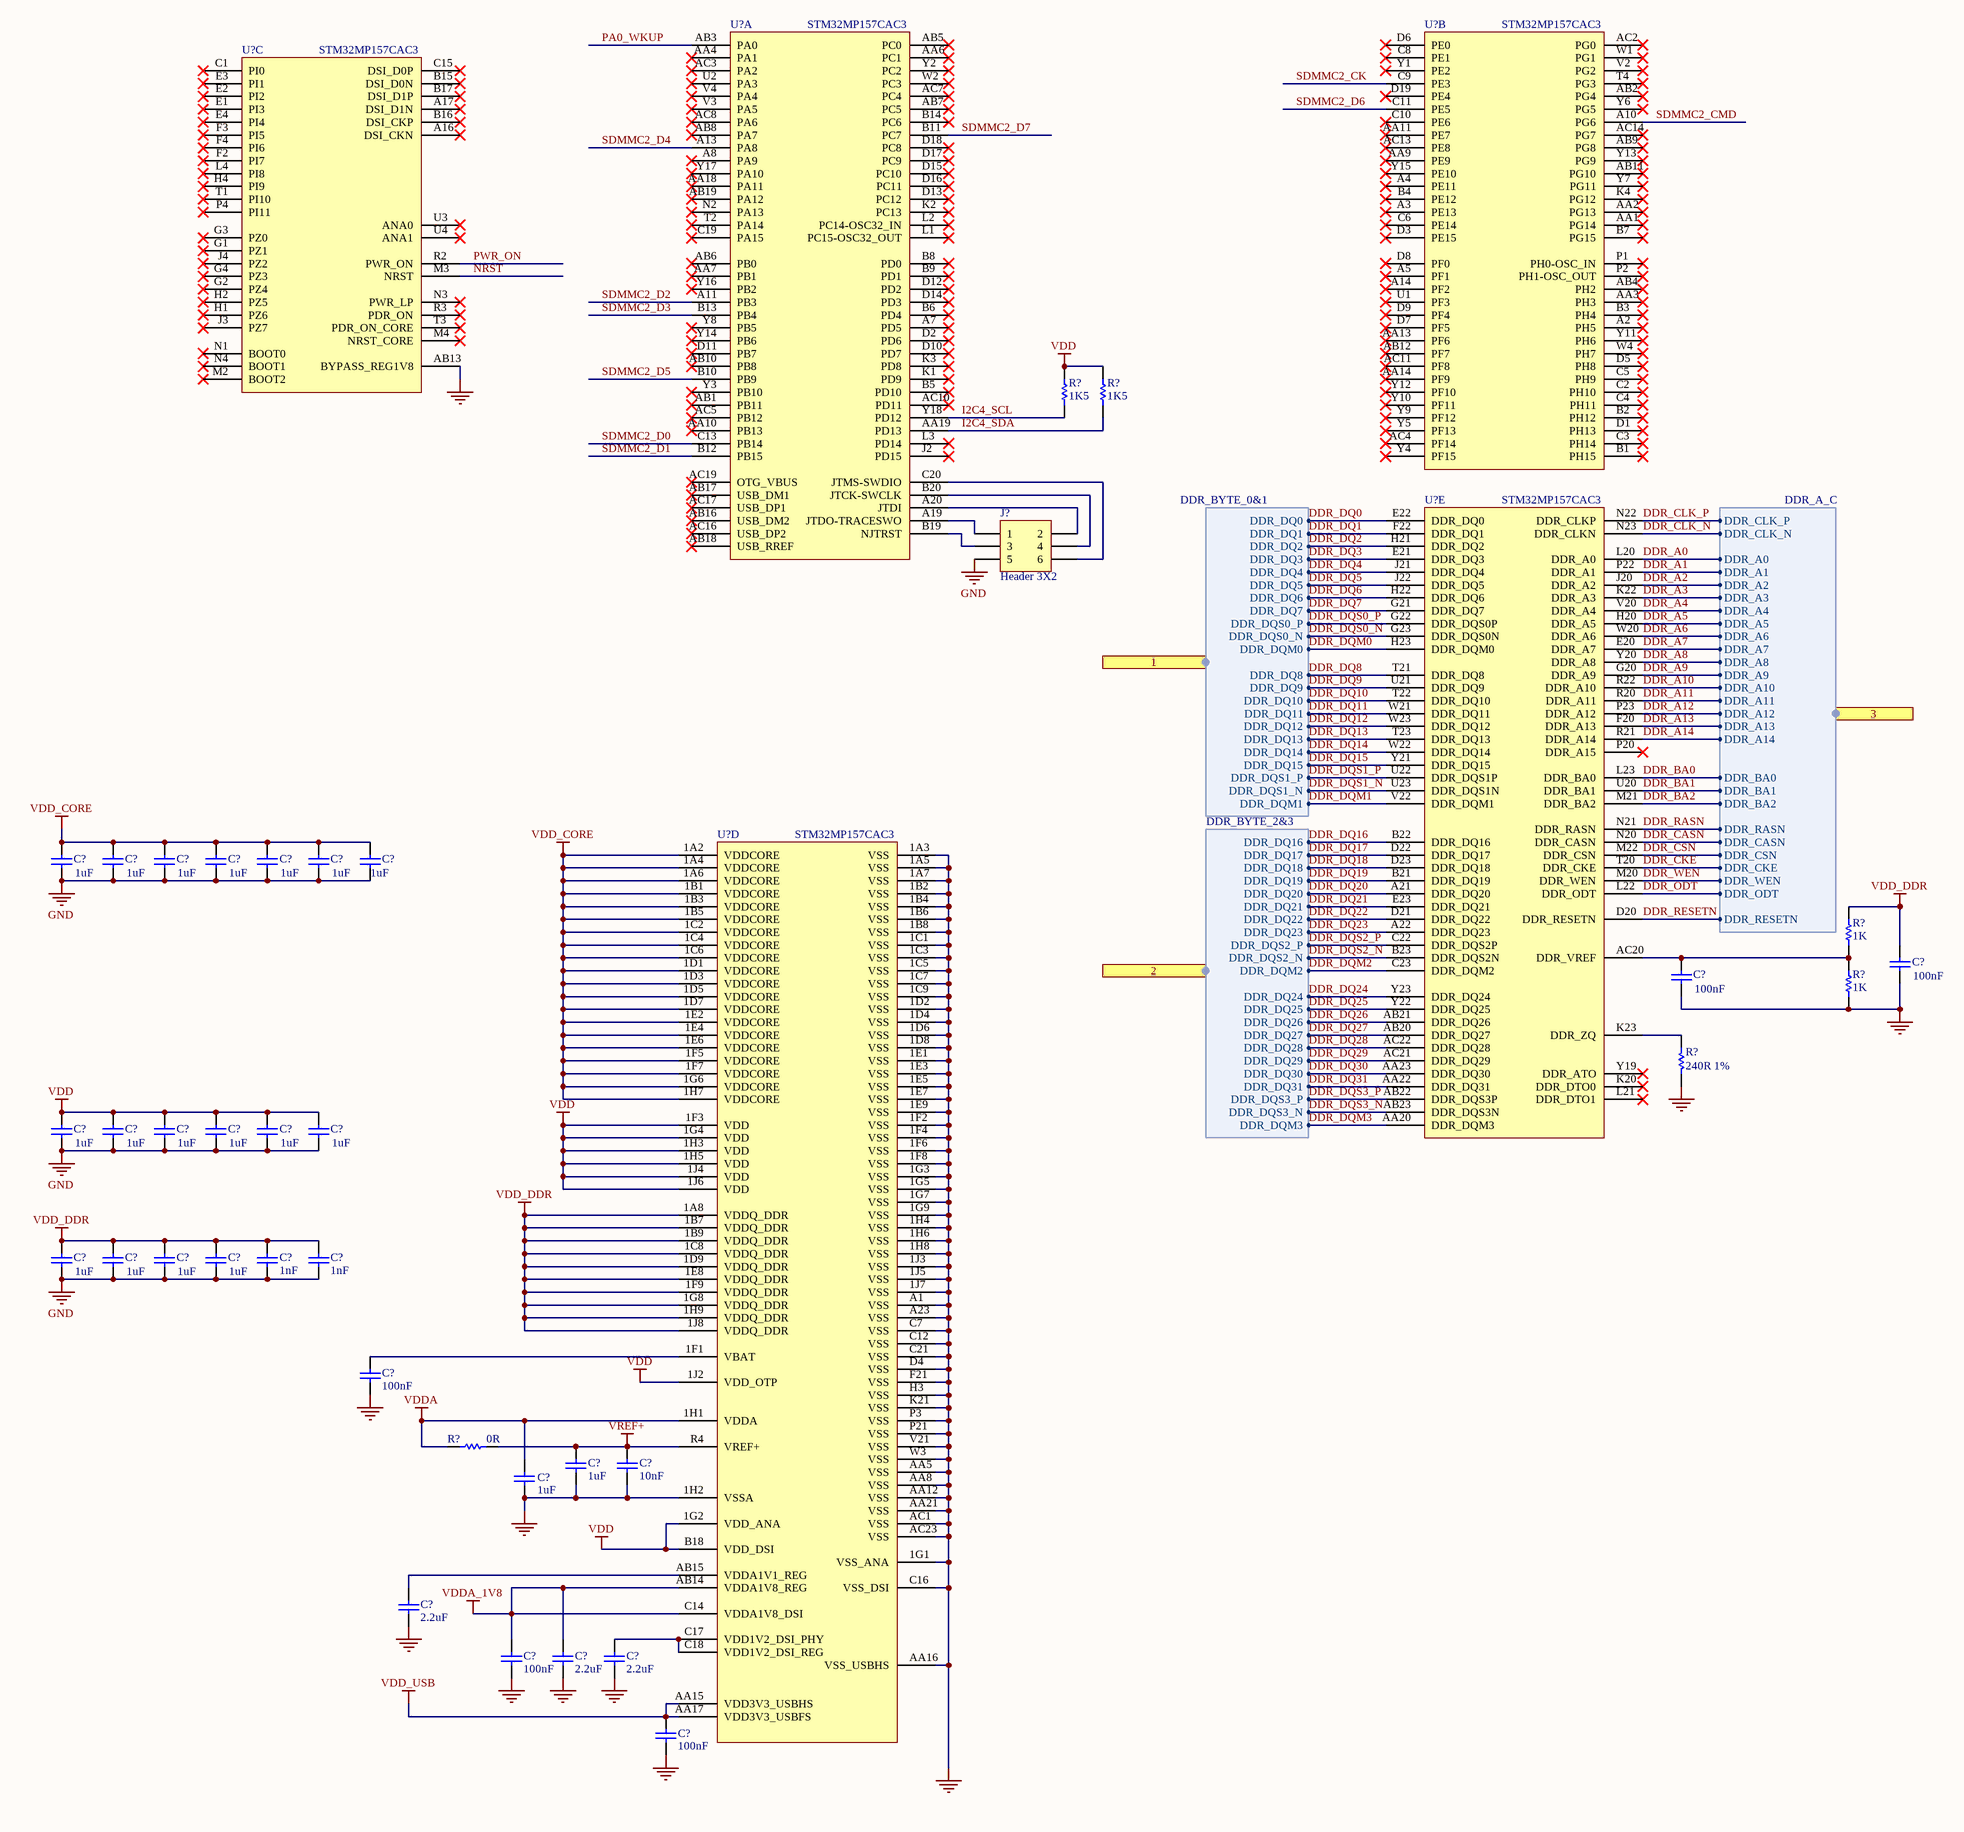
[diagram p10: RK3568-SOM-MCU.SchDoc]

### Parts
(Parts that share a designator on the sheet are numbered #1, #2 ... from top to bottom, then left to right.)
C?#49  value 1uF  [C0402]  (hidden comment: Capacitor)
C?#50  value 1uF  [C0402]  (hidden comment: Capacitor)
C?#51  value 1uF  [C0402]  (hidden comment: Capacitor)
C?#52  value 1uF  [C0402]  (hidden comment: Capacitor)
C?#53  value 1uF  [C0402]  (hidden comment: Capacitor)
C?#54  value 1uF  [C0402]  (hidden comment: Capacitor)
C?#55  value 1uF  [C0402]  (hidden comment: Capacitor)
C?#56  value 100nF  [C0402]  (hidden comment: Capacitor)
C?#57  value 100nF  [C0402]  (hidden comment: Capacitor)
C?#58  value 1uF  [C0402]  (hidden comment: Capacitor)
C?#59  value 1uF  [C0402]  (hidden comment: Capacitor)
C?#60  value 1uF  [C0402]  (hidden comment: Capacitor)
C?#61  value 1uF  [C0402]  (hidden comment: Capacitor)
C?#62  value 1uF  [C0402]  (hidden comment: Capacitor)
C?#63  value 1uF  [C0402]  (hidden comment: Capacitor)
C?#64  value 1uF  [C0402]  (hidden comment: Capacitor)
C?#65  value 1uF  [C0402]  (hidden comment: Capacitor)
C?#66  value 1uF  [C0402]  (hidden comment: Capacitor)
C?#67  value 1uF  [C0402]  (hidden comment: Capacitor)
C?#68  value 1nF  [C0402]  (hidden comment: Capacitor)
C?#69  value 1nF  [C0402]  (hidden comment: Capacitor)
C?#70  value 100nF  [C0402]  (hidden comment: Capacitor)
C?#71  value 1uF  [C0402]  (hidden comment: Capacitor)
C?#72  value 10nF  [C0402]  (hidden comment: Capacitor)
C?#73  value 1uF  [C0402]  (hidden comment: Capacitor)
C?#74  value 2.2uF  [C0402]  (hidden comment: Capacitor)
C?#75  value 100nF  [C0402]  (hidden comment: Capacitor)
C?#76  value 2.2uF  [C0402]  (hidden comment: Capacitor)
C?#77  value 2.2uF  [C0402]  (hidden comment: Capacitor)
C?#78  value 100nF  [C0402]  (hidden comment: Capacitor)
J?#6  Header 3X2  [Header3x2]
R?#39  value 1K5  [R0402]  (hidden comment: Resistor)
R?#40  value 1K5  [R0402]  (hidden comment: Resistor)
R?#41  value 1K  [R0402]  (hidden comment: Resistor)
R?#42  value 1K  [R0402]  (hidden comment: Resistor)
R?#43  value 240R 1%  [R0402]  (hidden comment: Resistor)
R?#44  value 0R  [R0402]  (hidden comment: Resistor)
U?#8  STM32MP157CAC3  [ICC_TFBGA361_12X12_STM32MP157CAC3_P050-065]  (part A of 5)
U?#9  STM32MP157CAC3  [ICC_TFBGA361_12X12_STM32MP157CAC3_P050-065]  (part B of 5)
U?#10  STM32MP157CAC3  [ICC_TFBGA361_12X12_STM32MP157CAC3_P050-065]  (part C of 5)
U?#11  STM32MP157CAC3  [ICC_TFBGA361_12X12_STM32MP157CAC3_P050-065]  (part E of 5)
U?#12  STM32MP157CAC3  [ICC_TFBGA361_12X12_STM32MP157CAC3_P050-065]  (part D of 5)

### Ports
1 (harness DDR_BYTE_0&1), 2 (harness DDR_BYTE_2&3), 3 (harness DDR_A_C)

### Harnesses
DDR_BYTE_0&1: DDR_DQ0, DDR_DQ1, DDR_DQ2, DDR_DQ3, DDR_DQ4, DDR_DQ5, DDR_DQ6, DDR_DQ7, DDR_DQS0_P, DDR_DQS0_N, DDR_DQM0, DDR_DQ8, DDR_DQ9, DDR_DQ10, DDR_DQ11, DDR_DQ12, DDR_DQ13, DDR_DQ14, DDR_DQ15, DDR_DQS1_P, DDR_DQS1_N, DDR_DQM1
DDR_A_C: DDR_CLK_P, DDR_CLK_N, DDR_A0, DDR_A1, DDR_A2, DDR_A3, DDR_A4, DDR_A5, DDR_A6, DDR_A7, DDR_A8, DDR_A9, DDR_A10, DDR_A11, DDR_A12, DDR_A13, DDR_A14, DDR_BA0, DDR_BA1, DDR_BA2, DDR_RASN, DDR_CASN, DDR_CSN, DDR_CKE, DDR_WEN, DDR_ODT, DDR_RESETN
DDR_BYTE_2&3: DDR_DQ16, DDR_DQ17, DDR_DQ18, DDR_DQ19, DDR_DQ20, DDR_DQ21, DDR_DQ22, DDR_DQ23, DDR_DQS2_P, DDR_DQS2_N, DDR_DQM2, DDR_DQ24, DDR_DQ25, DDR_DQ26, DDR_DQ27, DDR_DQ28, DDR_DQ29, DDR_DQ30, DDR_DQ31, DDR_DQS3_P, DDR_DQS3_N, DDR_DQM3

### Nets
GND: C?#49.1 C?#50.1 C?#51.1 C?#52.1 C?#53.1 C?#54.1 C?#55.1 C?#56.1 C?#57.1 C?#58.1 C?#59.1 C?#60.1 C?#61.1 C?#62.1 C?#63.1 C?#64.1 C?#65.1 C?#66.1 C?#67.1 C?#68.1 C?#69.1 C?#70.1 C?#71.1 C?#72.1 C?#73.1 C?#74.1 C?#75.1 C?#76.1 C?#77.1 C?#78.1 J?#6.5 R?#42.1 R?#43.2 U?#10.AB13(BYPASS_REG1V8) U?#12.1A3(VSS) U?#12.1A5(VSS) U?#12.1A7(VSS) U?#12.1B2(VSS) U?#12.1B4(VSS) U?#12.1B6(VSS) U?#12.1B8(VSS) U?#12.1C1(VSS) U?#12.1C3(VSS) U?#12.1C5(VSS) U?#12.1C7(VSS) U?#12.1C9(VSS) U?#12.1D2(VSS) U?#12.1D4(VSS) U?#12.1D6(VSS) U?#12.1D8(VSS) U?#12.1E1(VSS) U?#12.1E3(VSS) U?#12.1E5(VSS) U?#12.1E7(VSS) U?#12.1E9(VSS) U?#12.1F2(VSS) U?#12.1F4(VSS) U?#12.1F6(VSS) U?#12.1F8(VSS) U?#12.1G1(VSS_ANA) U?#12.1G3(VSS) U?#12.1G5(VSS) U?#12.1G7(VSS) U?#12.1G9(VSS) U?#12.1H2(VSSA) U?#12.1H4(VSS) U?#12.1H6(VSS) U?#12.1H8(VSS) U?#12.1J3(VSS) U?#12.1J5(VSS) U?#12.1J7(VSS) U?#12.A1(VSS) U?#12.A23(VSS) U?#12.AA5(VSS) U?#12.AA8(VSS) U?#12.AA12(VSS) U?#12.AA16(VSS_USBHS) U?#12.AA21(VSS) U?#12.AC1(VSS) U?#12.AC23(VSS) U?#12.C7(VSS) U?#12.C12(VSS) U?#12.C16(VSS_DSI) U?#12.C21(VSS) U?#12.D4(VSS) U?#12.F21(VSS) U?#12.H3(VSS) U?#12.K21(VSS) U?#12.P3(VSS) U?#12.P21(VSS) U?#12.V21(VSS) U?#12.W3(VSS)
VDD: C?#58.2 C?#59.2 C?#60.2 C?#61.2 C?#62.2 C?#63.2 R?#39.1 R?#40.1 U?#12.1F3(VDD) U?#12.1G2(VDD_ANA) U?#12.1G4(VDD) U?#12.1H3(VDD) U?#12.1H5(VDD) U?#12.1J2(VDD_OTP) U?#12.1J4(VDD) U?#12.1J6(VDD) U?#12.B18(VDD_DSI)
VDD_CORE: C?#49.2 C?#50.2 C?#51.2 C?#52.2 C?#53.2 C?#54.2 C?#55.2 U?#12.1A2(VDDCORE) U?#12.1A4(VDDCORE) U?#12.1A6(VDDCORE) U?#12.1B1(VDDCORE) U?#12.1B3(VDDCORE) U?#12.1B5(VDDCORE) U?#12.1C2(VDDCORE) U?#12.1C4(VDDCORE) U?#12.1C6(VDDCORE) U?#12.1D1(VDDCORE) U?#12.1D3(VDDCORE) U?#12.1D5(VDDCORE) U?#12.1D7(VDDCORE) U?#12.1E2(VDDCORE) U?#12.1E4(VDDCORE) U?#12.1E6(VDDCORE) U?#12.1F5(VDDCORE) U?#12.1F7(VDDCORE) U?#12.1G6(VDDCORE) U?#12.1H7(VDDCORE)
VDD_DDR: C?#56.2 C?#64.2 C?#65.2 C?#66.2 C?#67.2 C?#68.2 C?#69.2 R?#41.2 U?#12.1A8(VDDQ_DDR) U?#12.1B7(VDDQ_DDR) U?#12.1B9(VDDQ_DDR) U?#12.1C8(VDDQ_DDR) U?#12.1D9(VDDQ_DDR) U?#12.1E8(VDDQ_DDR) U?#12.1F9(VDDQ_DDR) U?#12.1G8(VDDQ_DDR) U?#12.1H9(VDDQ_DDR) U?#12.1J8(VDDQ_DDR)
VDD_USB: C?#78.2 U?#12.AA15(VDD3V3_USBHS) U?#12.AA17(VDD3V3_USBFS)
VDDA: C?#73.2 R?#44.1 U?#12.1H1(VDDA)
VDDA_1V8: C?#75.2 C?#76.2 U?#12.AB14(VDDA1V8_REG) U?#12.C14(VDDA1V8_DSI)
VREF+: C?#71.2 C?#72.2 R?#44.2 U?#12.R4(VREF+)
DDR_A0: U?#11.L20(DDR_A0) ; port 3.DDR_A0
DDR_A1: U?#11.P22(DDR_A1) ; port 3.DDR_A1
DDR_A2: U?#11.J20(DDR_A2) ; port 3.DDR_A2
DDR_A3: U?#11.K22(DDR_A3) ; port 3.DDR_A3
DDR_A4: U?#11.V20(DDR_A4) ; port 3.DDR_A4
DDR_A5: U?#11.H20(DDR_A5) ; port 3.DDR_A5
DDR_A6: U?#11.W20(DDR_A6) ; port 3.DDR_A6
DDR_A7: U?#11.E20(DDR_A7) ; port 3.DDR_A7
DDR_A8: U?#11.Y20(DDR_A8) ; port 3.DDR_A8
DDR_A9: U?#11.G20(DDR_A9) ; port 3.DDR_A9
DDR_A10: U?#11.R22(DDR_A10) ; port 3.DDR_A10
DDR_A11: U?#11.R20(DDR_A11) ; port 3.DDR_A11
DDR_A12: U?#11.P23(DDR_A12) ; port 3.DDR_A12
DDR_A13: U?#11.F20(DDR_A13) ; port 3.DDR_A13
DDR_A14: U?#11.R21(DDR_A14) ; port 3.DDR_A14
DDR_BA0: U?#11.L23(DDR_BA0) ; port 3.DDR_BA0
DDR_BA1: U?#11.U20(DDR_BA1) ; port 3.DDR_BA1
DDR_BA2: U?#11.M21(DDR_BA2) ; port 3.DDR_BA2
DDR_CASN: U?#11.N20(DDR_CASN) ; port 3.DDR_CASN
DDR_CKE: U?#11.T20(DDR_CKE) ; port 3.DDR_CKE
DDR_CLK_N: U?#11.N23(DDR_CLKN) ; port 3.DDR_CLK_N
DDR_CLK_P: U?#11.N22(DDR_CLKP) ; port 3.DDR_CLK_P
DDR_CSN: U?#11.M22(DDR_CSN) ; port 3.DDR_CSN
DDR_DQ0: U?#11.E22(DDR_DQ0) ; port 1.DDR_DQ0
DDR_DQ1: U?#11.F22(DDR_DQ1) ; port 1.DDR_DQ1
DDR_DQ2: U?#11.H21(DDR_DQ2) ; port 1.DDR_DQ2
DDR_DQ3: U?#11.E21(DDR_DQ3) ; port 1.DDR_DQ3
DDR_DQ4: U?#11.J21(DDR_DQ4) ; port 1.DDR_DQ4
DDR_DQ5: U?#11.J22(DDR_DQ5) ; port 1.DDR_DQ5
DDR_DQ6: U?#11.H22(DDR_DQ6) ; port 1.DDR_DQ6
DDR_DQ7: U?#11.G21(DDR_DQ7) ; port 1.DDR_DQ7
DDR_DQ8: U?#11.T21(DDR_DQ8) ; port 1.DDR_DQ8
DDR_DQ9: U?#11.U21(DDR_DQ9) ; port 1.DDR_DQ9
DDR_DQ10: U?#11.T22(DDR_DQ10) ; port 1.DDR_DQ10
DDR_DQ11: U?#11.W21(DDR_DQ11) ; port 1.DDR_DQ11
DDR_DQ12: U?#11.W23(DDR_DQ12) ; port 1.DDR_DQ12
DDR_DQ13: U?#11.T23(DDR_DQ13) ; port 1.DDR_DQ13
DDR_DQ14: U?#11.W22(DDR_DQ14) ; port 1.DDR_DQ14
DDR_DQ15: U?#11.Y21(DDR_DQ15) ; port 1.DDR_DQ15
DDR_DQ16: U?#11.B22(DDR_DQ16) ; port 2.DDR_DQ16
DDR_DQ17: U?#11.D22(DDR_DQ17) ; port 2.DDR_DQ17
DDR_DQ18: U?#11.D23(DDR_DQ18) ; port 2.DDR_DQ18
DDR_DQ19: U?#11.B21(DDR_DQ19) ; port 2.DDR_DQ19
DDR_DQ20: U?#11.A21(DDR_DQ20) ; port 2.DDR_DQ20
DDR_DQ21: U?#11.E23(DDR_DQ21) ; port 2.DDR_DQ21
DDR_DQ22: U?#11.D21(DDR_DQ22) ; port 2.DDR_DQ22
DDR_DQ23: U?#11.A22(DDR_DQ23) ; port 2.DDR_DQ23
DDR_DQ24: U?#11.Y23(DDR_DQ24) ; port 2.DDR_DQ24
DDR_DQ25: U?#11.Y22(DDR_DQ25) ; port 2.DDR_DQ25
DDR_DQ26: U?#11.AB21(DDR_DQ26) ; port 2.DDR_DQ26
DDR_DQ27: U?#11.AB20(DDR_DQ27) ; port 2.DDR_DQ27
DDR_DQ28: U?#11.AC22(DDR_DQ28) ; port 2.DDR_DQ28
DDR_DQ29: U?#11.AC21(DDR_DQ29) ; port 2.DDR_DQ29
DDR_DQ30: U?#11.AA23(DDR_DQ30) ; port 2.DDR_DQ30
DDR_DQ31: U?#11.AA22(DDR_DQ31) ; port 2.DDR_DQ31
DDR_DQM0: U?#11.H23(DDR_DQM0) ; port 1.DDR_DQM0
DDR_DQM1: U?#11.V22(DDR_DQM1) ; port 1.DDR_DQM1
DDR_DQM2: U?#11.C23(DDR_DQM2) ; port 2.DDR_DQM2
DDR_DQM3: U?#11.AA20(DDR_DQM3) ; port 2.DDR_DQM3
DDR_DQS0_N: U?#11.G23(DDR_DQS0N) ; port 1.DDR_DQS0_N
DDR_DQS0_P: U?#11.G22(DDR_DQS0P) ; port 1.DDR_DQS0_P
DDR_DQS1_N: U?#11.U23(DDR_DQS1N) ; port 1.DDR_DQS1_N
DDR_DQS1_P: U?#11.U22(DDR_DQS1P) ; port 1.DDR_DQS1_P
DDR_DQS2_N: U?#11.B23(DDR_DQS2N) ; port 2.DDR_DQS2_N
DDR_DQS2_P: U?#11.C22(DDR_DQS2P) ; port 2.DDR_DQS2_P
DDR_DQS3_N: U?#11.AB23(DDR_DQS3N) ; port 2.DDR_DQS3_N
DDR_DQS3_P: U?#11.AB22(DDR_DQS3P) ; port 2.DDR_DQS3_P
DDR_ODT: U?#11.L22(DDR_ODT) ; port 3.DDR_ODT
DDR_RASN: U?#11.N21(DDR_RASN) ; port 3.DDR_RASN
DDR_RESETN: U?#11.D20(DDR_RESETN) ; port 3.DDR_RESETN
DDR_WEN: U?#11.M20(DDR_WEN) ; port 3.DDR_WEN
I2C4_SCL: R?#39.2 U?#8.Y18(PD12)
I2C4_SDA: R?#40.2 U?#8.AA19(PD13)
NRST: U?#10.M3(NRST)
PA0_WKUP: U?#8.AB3(PA0)
PWR_ON: U?#10.R2(PWR_ON)
SDMMC2_CK: U?#9.C9(PE3)
SDMMC2_CMD: U?#9.A10(PG6)
SDMMC2_D0: U?#8.C13(PB14)
SDMMC2_D1: U?#8.B12(PB15)
SDMMC2_D2: U?#8.A11(PB3)
SDMMC2_D3: U?#8.B13(PB4)
SDMMC2_D4: U?#8.A13(PA8)
SDMMC2_D5: U?#8.B10(PB9)
SDMMC2_D6: U?#9.C11(PE5)
SDMMC2_D7: U?#8.B11(PC7)
NetC?#57_2: C?#57.2 R?#41.1 R?#42.2 U?#11.AC20(DDR_VREF)
NetC?#70_2: C?#70.2 U?#12.1F1(VBAT)
NetC?#74_2: C?#74.2 U?#12.AB15(VDDA1V1_REG)
NetC?#77_2: C?#77.2 U?#12.C17(VDD1V2_DSI_PHY) U?#12.C18(VDD1V2_DSI_REG)
NetJ?#6_1: J?#6.1 U?#8.A19(JTDO-TRACESWO)
NetJ?#6_2: J?#6.2 U?#8.A20(JTDI)
NetJ?#6_3: J?#6.3 U?#8.B19(NJTRST)
NetJ?#6_4: J?#6.4 U?#8.B20(JTCK-SWCLK)
NetJ?#6_6: J?#6.6 U?#8.C20(JTMS-SWDIO)
NetR?#43_1: R?#43.1 U?#11.K23(DDR_ZQ)

Not connected (* = marked no-connect by the designer): U?#8 A7(PD5)* A8(PA9)* AA4(PA1)* AA6(PC1)* AA7(PB1)* AA10(PB13)* AA18(PA11)* AB1(PB11)* AB5(PC0)* AB6(PB0)* AB7(PC5)* AB8(PA7)* AB10(PB8)* AB16(USB_DM2)* AB17(USB_DM1)* AB18(USB_RREF)* AB19(PA12)* AC3(PA2)* AC5(PB12)* AC7(PC4)* AC8(PA6)* AC10(PD11)* AC16(USB_DP2)* AC17(USB_DP1)* AC19(OTG_VBUS)* B5(PD10)* B6(PD4)* B8(PD0)* B9(PD1)* B14(PC6)* C19(PA15)* D2(PD6)* D10(PD7)* D11(PB7)* D12(PD2)* D13(PC12)* D14(PD3)* D15(PC10)* D16(PC11)* D17(PC9)* D18(PC8)* J2(PD15)* K1(PD9)* K2(PC13)* K3(PD8)* L1(PC15-OSC32_OUT)* L2(PC14-OSC32_IN)* L3(PD14)* N2(PA13)* T2(PA14)* U2(PA3)* V3(PA5)* V4(PA4)* W2(PC3)* Y2(PC2)* Y3(PB10)* Y8(PB5)* Y14(PB6)* Y16(PB2)* Y17(PA10)*; U?#9 A2(PH5)* A3(PE13)* A4(PE11)* A5(PF1)* A14(PF2)* AA1(PG14)* AA2(PG13)* AA3(PH3)* AA9(PE9)* AA11(PE7)* AA13(PF6)* AA14(PF9)* AB2(PG4)* AB4(PH2)* AB9(PG8)* AB11(PG10)* AB12(PF7)* AC2(PG0)* AC4(PF14)* AC11(PF8)* AC13(PE8)* AC14(PG7)* B1(PH15)* B2(PH12)* B3(PH4)* B4(PE12)* B7(PG15)* C2(PH10)* C3(PH14)* C4(PH11)* C5(PH9)* C6(PE14)* C8(PE1)* C10(PE6)* D1(PH13)* D3(PE15)* D5(PH8)* D6(PE0)* D7(PF5)* D8(PF0)* D9(PF4)* D19(PE4)* K4(PG12)* P1(PH0-OSC_IN)* P2(PH1-OSC_OUT)* T4(PG3)* U1(PF3)* V2(PG2)* W1(PG1)* W4(PH7)* Y1(PE2)* Y4(PF15)* Y5(PF13)* Y6(PG5)* Y7(PG11)* Y9(PF12)* Y10(PF11)* Y11(PH6)* Y12(PF10)* Y13(PG9)* Y15(PE10)*; U?#10 A16(DSI_CKN)* A17(DSI_D1N)* B15(DSI_D0N)* B16(DSI_CKP)* B17(DSI_D1P)* C1(PI0)* C15(DSI_D0P)* E1(PI3)* E2(PI2)* E3(PI1)* E4(PI4)* F2(PI7)* F3(PI5)* F4(PI6)* G1(PZ1)* G2(PZ4)* G3(PZ0)* G4(PZ3)* H1(PZ6)* H2(PZ5)* H4(PI9)* J3(PZ7)* J4(PZ2)* L4(PI8)* M2(BOOT2)* M4(NRST_CORE)* N1(BOOT0)* N3(PWR_LP)* N4(BOOT1)* P4(PI11)* R3(PDR_ON)* T1(PI10)* T3(PDR_ON_CORE)* U3(ANA0)* U4(ANA1)*; U?#11 K20(DDR_DTO0)* L21(DDR_DTO1)* P20(DDR_A15)* Y19(DDR_ATO)*

### Notes on the sheet
- Title
- Size:
- Date:
- File:
- A2
- Number:
- Time:
- Revision:
- Sheet
- of

### Library data of the parts
C?#49-C?#55 C?#58-C?#67 C?#71 C?#73 = MCD-00095: Capacitor, MLCC, 1uF, 25V, X5R, +/-10%, 0402, T=0,5mm; Manufacturer_Part_Number: GRM155R61E105KA12; Manufacturer: MURATA; Alternate_Manufacturer_Part_Number: GRM155R60J105KE19; ECCN_US: EAR99; ECCN_EU: NEC; Provided_By: SUBCO; Order_Code_RS: 846-7287; Internal_Part_Number: MCD-00095; Status: Released; Package: C0402; ComponentLink1Description: Datasheet; Part_Type: Capacitor; Alternate_Manufacturer: MURATA; ComponentLink1URL: http://tunmcdsvn.tun.st.com/Component_Datasheet_Library/Trunk/Capacitors/Murata_Capacitor_GR_series; Order_Code_Digikey: 490-10017-1-ND; Order_Code_Farnell: 2218855
C?#56 C?#57 C?#70 C?#78 = MCD-00006: Capacitor, MLCC, 100nF, 16V, X7R, +/-10%, 0402, T=0.5mm; Manufacturer_Part_Number: CC0402KRX7R7BB104; Manufacturer: YAGEO; Alternate_Manufacturer: MURATA; Alternate_Manufacturer_Part_Number: GCM155R71C104KA55D; ECCN_US: EAR99; ECCN_EU: NEC; Provided_By: SUBCO; Order_Code_RS: 616-9701; Internal_Part_Number: MCD-00006; ComponentLink1Description: Datasheet; Status: Released; Part_Type: Capacitor; Package: C0402; ComponentLink1URL: http://tunmcdsvn.tun.st.com/Component_Datasheet_Library/Trunk/Capacitors/Yageo_Multilayer_Capacitor_X7R_series_100pF_to_22uF; Order_Code_Digikey: 311-1338-1-ND; Order_Code_Farnell: 9402047
C?#68 C?#69 = MCD-00198: Capacitor, MLCC, 1nF, 16V, X7R, +/-10%, 0402, T=0.5mm; Manufacturer_Part_Number: CC0402KRX7R7BB102; Manufacturer: YAGEO; Provided_By: SUBCO; ECCN_EU: NEC; ECCN_US: EAR99; Internal_Part_Number: MCD-00198; Status: Released; Part_Type: Capacitor; Package: C0402; ComponentLink1Description: Datasheet; ComponentLink1URL: http://tunmcdsvn.tun.st.com/Component_Datasheet_Library/Trunk/Capacitors/Yageo_Multilayer_Capacitor_X7R_series_100pF_to_22uF; Order_Code_Digikey: 311-1352-1-ND; Order_Code_Farnell: 2370642; Order_Code_RS: N/A
C?#72 = MCD-00011: Capacitor, MLCC, 10nF, 16V, X7R, +/-10%, 0402, T=0.5mm; Manufacturer_Part_Number: CC0402KRX7R7BB103; Manufacturer: YAGEO; ECCN_US: EAR99; ECCN_EU: NEC; Provided_By: SUBCO; Order_Code_RS: 669-8688; Internal_Part_Number: MCD-00011; Status: Released; Part_Type: Capacitor; Package: C0402; ComponentLink1Description: Datasheet; ComponentLink1URL: http://tunmcdsvn.tun.st.com/Component_Datasheet_Library/Trunk/Capacitors/Yageo_Multilayer_Capacitor_X7R_series_100pF_to_22uF; Order_Code_Digikey: 311-1042-1-ND; Order_Code_Farnell: 3019275
C?#74 C?#76 C?#77 = MCD-01823: Capacitor,MLCC, 2.2uF, 6V3, X5R,+/-10%, 0402, T=0.5mm; Manufacturer_Part_Number: GRM155R60J225KE95D; Manufacturer: MURATA; ECCN_US: EAR99; ECCN_EU: NEC; Provided_By: SUBCO; Order_Code_RS: 172-6478; Internal_Part_Number: MCD-01823; Status: Released; Part_Type: Capacitor; Package: C0402; ComponentLink1Description: Datasheet; ComponentLink1URL: http://tunmcdsvn.tun.st.com/Component_Datasheet_Library/Trunk/Capacitors/Murata_Capacitor_GR_series; Order_Code_Digikey: 490-12532-1-ND; Order_Code_Farnell: 2695865
C?#75 = MCD-00006: Capacitor, MLCC, 100nF, 16V, X7R, +/-10%, 0402, T=0.5mm; Manufacturer_Part_Number: CC0402KRX7R7BB104; Manufacturer: YAGEO; Alternate_Manufacturer_Part_Number: GCM155R71C104KA55D; Alternate_Manufacturer: MURATA; ECCN_US: EAR99; ECCN_EU: NEC; Provided_By: SUBCO; Order_Code_RS: 616-9701; Internal_Part_Number: MCD-00006; Status: Released; Part_Type: Capacitor; Package: C0402; ComponentLink1Description: Datasheet; ComponentLink1URL: http://tunmcdsvn.tun.st.com/Component_Datasheet_Library/Trunk/Capacitors/Yageo_Multilayer_Capacitor_X7R_series_100pF_to_22uF; Order_Code_Digikey: 311-1338-1-ND; Order_Code_Farnell: 9402047
J?#6 = Header 3X2: Header, 2-Pin, Dual row; Manufacturer: Harwin; Manufacturer Part Number 1: M20-9980346; Part Description: Connector Header Through Hole 6 position 0.100" (2.54mm); Contact Resistance: 25mR; Max Current Rating: 3A; Number of Positions: 6; Gender: Male; Connector Type: Male Pin; Insulation Resistance: 10GR; Pitch: 2.54mm; Row Spacing: 0.1inch; Supplier 1: Digi-Key; Supplier Part Number 1: 952-2121-ND; RoHS: Yes; Stock 1: 46604; Pricing 1: 1 = 0,24000, 10 = 0,22900, 100 = 0,15860, 500 = 0,13420, 1000 = 0,10980, 5000 = 0,09760, 10000 = 0,08845 (USD); Mount: Through Hole; Color: Black; Contact Material: Brass,Bronze; Housing Color: Black; Housing Material: Nylon; Contact Plating: Tin; Min Operating Temperature: -40°C; Max Operating Temperature: 105°C; Package Quantity: 1000; Packaging: Bag; Termination: Solder; Number of Rows: 2; Number of Contacts: 6; Orientation: Straight; Current Rating: 3A; Length: 7.62mm; Depth: 5.08mm; Contact Mating Length: 0.24inch; Radiation Hardening: No; REACH SVHC: No SVHC; ComponentLink1URL: http://uk.rs-online.com/webdocs/1406/0900766b81406898.pdf; ComponentLink1Description: http://uk.rs-online.com/webdocs/1406/0900766b81406898.pdf; ComponentLink2URL: https://www.verical.com/server-webapp/html/getDatasheet?partID=483857; ComponentLink2Description: https://www.verical.com/server-webapp/html/getDatasheet?partID=483857; ComponentLink3URL: http://www.farnell.com/cad/112195.pdf; ComponentLink3Description: http://www.farnell.com/cad/112195.pdf
R?#39 R?#40 = MCD-00068: Resistor,1K5,0402,1%,1/16W; Manufacturer_Part_Number: RC0402FR-071K5L; Manufacturer: YAGEO; ECCN_US: EAR99; ECCN_EU: NEC; Provided_By: SUBCO; Internal_Part_Number: MCD-00068; ComponentLink1Description: Datasheet; Status: Released; Part_Type: Resistor; ComponentLink1URL: http://tunmcdsvn.tun.st.com/Component_Datasheet_Library/Trunk/Resistors/Yageo_Resistor_RC0402-series; Package: R0402; Order_Code_Digikey: 311-1.50KLRCT-ND; Order_Code_Farnell: 9239251; Order_Code_RS: N/A
R?#41 R?#42 = MCD-00061: Resistor,1K,0402,1%,1/16W; Manufacturer_Part_Number: RC0402FR-071KL; Manufacturer: YAGEO; Provided_By: SUBCO; ECCN_EU: NEC; ECCN_US: EAR99; Internal_Part_Number: MCD-00061; Status: Released; Part_Type: Resistor; Package: R0402; ComponentLink1Description: Datasheet; ComponentLink1URL: http://tunmcdsvn.tun.st.com/Component_Datasheet_Library/Trunk/Resistors/Yageo_Resistor_RC0402-series; Order_Code_Digikey: 311-1.00KLRCT-ND; Order_Code_Farnell: 9239235; Order_Code_RS: N/A
R?#43 = MCD-00120: Resistor,240R,0402,1%,1/16W; Manufacturer_Part_Number: RC0402FR-07240RL; Manufacturer: YAGEO; ECCN_US: EAR99; ECCN_EU: NEC; Provided_By: SUBCO; Internal_Part_Number: MCD-00120; ComponentLink1Description: Datasheet; Status: Released; Part_Type: Resistor; ComponentLink1URL: http://tunmcdsvn.tun.st.com/Component_Datasheet_Library/Trunk/Resistors/Yageo_Resistor_RC0402-series; Package: R0402; Order_Code_Digikey: 311-240LRCT-ND; Order_Code_Farnell: 1458766; Order_Code_RS: N/A
R?#44 = MCD-00052: Resistor,0R,0402,5%,1/16W; Manufacturer_Part_Number: RC0402JR-070RL; Manufacturer: YAGEO; ECCN_US: EAR99; ECCN_EU: NEC; Provided_By: SUBCO; Order_Code_RS: 618-5804; Internal_Part_Number: MCD-00052; Status: Released; Part_Type: Resistor; ComponentLink1Description: Datasheet; ComponentLink1URL: http://tunmcdsvn.tun.st.com/Component_Datasheet_Library/Trunk/Resistors/Yageo_Resistor_RC0402-series; Package: R0402; Order_Code_Digikey: 311-0.0JRCT-ND; Order_Code_Farnell: 9232516RL
U?#8-U?#12 = MCD-00677: MPU TFBGA12x12 secure boot+crypto; Part_Type: IC; Manufacturer: STMICROELECTRONICS; BMS_Part_Number: 9175503; ECCN_US: 5A002A4; ECCN_EU: NEC; Provided_By: SUBCO with ST control; Company_Nationality: Netherlands; Internal_Part_Number: MCD-00677; Value: STM32MP157CAC3; Status: Footprint available; Manufacturer_Part_Number: STM32MP157CAC3; ComponentLink1Description: Datasheet; ComponentLink1URL: http://tunmcdsvn.tun.st.com/Component_Datasheet_Library/Trunk/IC/STM_MPU_12x12_POA_DM00342580_POA12x12; Export_Juridiction: EU; California_Proposition_65: N/A

## Nets that join several sheets
1V8: Designator/Ethernet (R?_Ethernet#37.2), RK3568-SOM-PWR (R?#32.2), Designator/USB (R?_USB#37.2)
3V3: Designator/Ethernet (14 pins), RK3568-SOM-PWR (13 pins), Designator/USB (14 pins)
GND: Designator/Ethernet (50 pins), RK3568-SOM-PWR (25 pins), RK3568-SOM-DDR3_MEM (164 pins), RK3568-SOM-EDGE_CONNECTOR (124 pins), RK3568-SOM-MCU (92 pins), Designator/USB (50 pins)
SHGND: Designator/Ethernet (5 pins), Designator/USB (5 pins)
VDD: Designator/Ethernet (12 pins), RK3568-SOM-EDGE_CONNECTOR (17 pins), RK3568-SOM-MCU (17 pins), Designator/USB (12 pins)
VDD_CORE: RK3568-SOM-EDGE_CONNECTOR (27 pins), RK3568-SOM-MCU (27 pins)
VDD_DDR: RK3568-SOM-EDGE_CONNECTOR (18 pins), RK3568-SOM-MCU (18 pins)
VDD_USB: RK3568-SOM-EDGE_CONNECTOR (C?#48.2 U?#7.AA15 U?#7.AA17), RK3568-SOM-MCU (C?#78.2 U?#12.AA15 U?#12.AA17)
VDDA: RK3568-SOM-EDGE_CONNECTOR (C?#43.2 R?#38.1 U?#7.1H1), RK3568-SOM-MCU (C?#73.2 R?#44.1 U?#12.1H1)
VDDA_1V8: RK3568-SOM-EDGE_CONNECTOR (C?#45.2 C?#46.2 U?#7.AB14 U?#7.C14), RK3568-SOM-MCU (C?#75.2 C?#76.2 U?#12.AB14 U?#12.C14)
VREF+: RK3568-SOM-EDGE_CONNECTOR (C?#41.2 C?#42.2 R?#38.2 U?#7.R4), RK3568-SOM-MCU (C?#71.2 C?#72.2 R?#44.2 U?#12.R4)
Gen_25MHz: Designator/Ethernet (DD?_Ethernet.46 R?_Ethernet#25.2 R?_Ethernet#32.2), RK3568-SOM-PWR (DD?.46 R?#20.2 R?#27.2), Designator/USB (DD?_USB.46 R?_USB#25.2 R?_USB#32.2)
NetC?#13_1: Designator/Ethernet (C?_Ethernet#13.1 DD?_Ethernet.13), RK3568-SOM-PWR (C?#13.1 DD?.13), Designator/USB (C?_USB#13.1 DD?_USB.13)
NetDD?_14: Designator/Ethernet (DD?_Ethernet.14 R?_Ethernet#21.2), RK3568-SOM-PWR (DD?.14 R?#16.2), Designator/USB (DD?_USB.14 R?_USB#21.2)
NetDD?_15: Designator/Ethernet (DD?_Ethernet.15 R?_Ethernet#23.2), RK3568-SOM-PWR (DD?.15 R?#18.2), Designator/USB (DD?_USB.15 R?_USB#23.2)
NetDD?_16: Designator/Ethernet (DD?_Ethernet.16), RK3568-SOM-PWR (DD?.16), Designator/USB (DD?_USB.16)
NetDD?_17: Designator/Ethernet (DD?_Ethernet.17), RK3568-SOM-PWR (DD?.17), Designator/USB (DD?_USB.17)
NetDD?_18: Designator/Ethernet (DD?_Ethernet.18), RK3568-SOM-PWR (DD?.18), Designator/USB (DD?_USB.18)
NetDD?_19: Designator/Ethernet (DD?_Ethernet.19), RK3568-SOM-PWR (DD?.19), Designator/USB (DD?_USB.19)
NetDD?_20: Designator/Ethernet (DD?_Ethernet.20), RK3568-SOM-PWR (DD?.20), Designator/USB (DD?_USB.20)
NetDD?_21: Designator/Ethernet (DD?_Ethernet.21), RK3568-SOM-PWR (DD?.21), Designator/USB (DD?_USB.21)
NetDD?_34: Designator/Ethernet (DD?_Ethernet.34 R?_Ethernet#35.1), RK3568-SOM-PWR (DD?.34 R?#30.1), Designator/USB (DD?_USB.34 R?_USB#35.1)
NetDD?_35: Designator/Ethernet (DD?_Ethernet.35 R?_Ethernet#26.1), RK3568-SOM-PWR (DD?.35 R?#21.1), Designator/USB (DD?_USB.35 R?_USB#26.1)
NetDD?_37: Designator/Ethernet (DD?_Ethernet.37), RK3568-SOM-PWR (DD?.37), Designator/USB (DD?_USB.37)
NetR62_Ethernet_1: Designator/Ethernet (R62_Ethernet.1 U12_Ethernet.12), Designator/USB (R62_USB.1 U12_USB.12)
NetR68_Ethernet_1: Designator/Ethernet (R68_Ethernet.1), Designator/USB (R68_USB.1)
NetR69_Ethernet_1: Designator/Ethernet (R69_Ethernet.1), Designator/USB (R69_USB.1)
NetR76_Ethernet_1: Designator/Ethernet (R76_Ethernet.1), Designator/USB (R76_USB.1)
NetR77_Ethernet_1: Designator/Ethernet (R77_Ethernet.1), Designator/USB (R77_USB.1)
NetR?#2_2: Designator/Ethernet (R?_Ethernet#2.2), RK3568-SOM-PWR (R?#2.2), Designator/USB (R?_USB#2.2)
NetR?#4_2: Designator/Ethernet (R?_Ethernet#9.2), RK3568-SOM-PWR (R?#4.2), Designator/USB (R?_USB#9.2)
NetR?#6_2: Designator/Ethernet (R?_Ethernet#11.2), RK3568-SOM-PWR (R?#6.2), Designator/USB (R?_USB#11.2)
NetR?#7_2: Designator/Ethernet (R?_Ethernet#12.2), RK3568-SOM-PWR (R?#7.2), Designator/USB (R?_USB#12.2)
NetR?#10_2: Designator/Ethernet (R?_Ethernet#15.2), RK3568-SOM-PWR (R?#10.2), Designator/USB (R?_USB#15.2)
NetR?#13_2: Designator/Ethernet (R?_Ethernet#18.2), RK3568-SOM-PWR (R?#13.2), Designator/USB (R?_USB#18.2)
NetSB4_Ethernet_1: Designator/Ethernet (SB4_Ethernet.1), Designator/USB (SB4_USB.1)
NetU12_Ethernet_13: Designator/Ethernet (U12_Ethernet.13), Designator/USB (U12_USB.13)
NetU12_Ethernet_16: Designator/Ethernet (U12_Ethernet.16), Designator/USB (U12_USB.16)
NetU12_Ethernet_17: Designator/Ethernet (U12_Ethernet.17), Designator/USB (U12_USB.17)
NetU12_Ethernet_18: Designator/Ethernet (U12_Ethernet.18), Designator/USB (U12_USB.18)

## Assembly variants
RK3568-SOM Release: all parts fitted